# EAGLE design Stericlinic_01 (EAGLE 6.3)

## Sheet 1 of 3
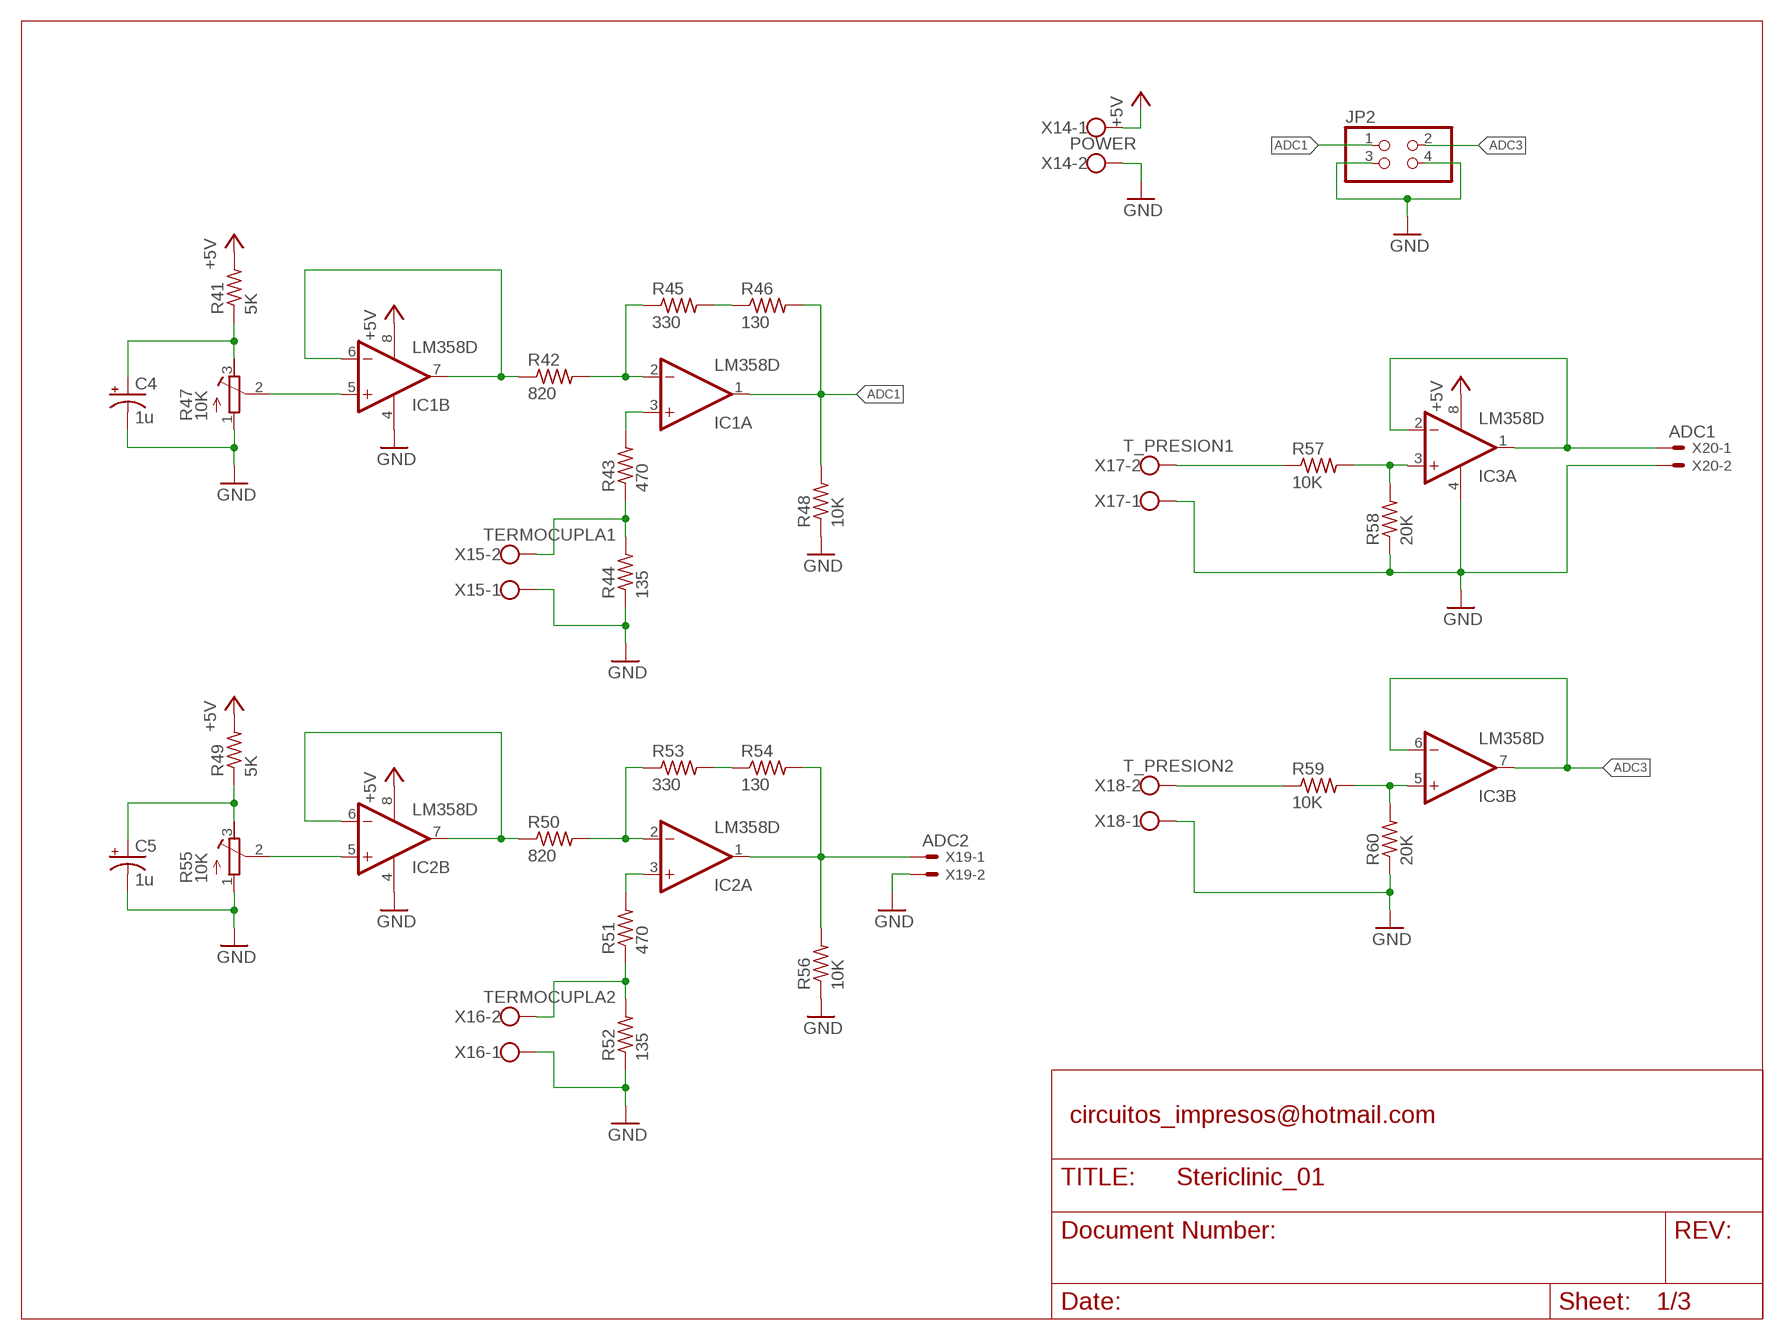
[diagram p0: schematic, sheet 1]

### Parts
C4  1u  CPOL-USB/3528-21W  [B/3528-21W]
C5  1u  CPOL-USB/3528-21W  [B/3528-21W]
IC1  LM358D  [SO08]
IC2  LM358D  [SO08]
IC3  LM358D  [SO08]
JP2  PINHD-2X2  [2X02]
R41  5K  R-US_R1206  [R1206]
R42  820  R-US_R0603  [R0603]
R43  470  R-US_R0603  [R0603]
R44  135  R-US_R0603  [R0603]
R45  330  R-US_R0603  [R0603]
R46  130  R-US_R0603  [R0603]
R47  10K  R-TRIMM64W  [RTRIM64W]
R48  10K  R-US_R0603  [R0603]
R49  5K  R-US_R1206  [R1206]
R50  820  R-US_R0603  [R0603]
R51  470  R-US_R0603  [R0603]
R52  135  R-US_R0603  [R0603]
R53  330  R-US_R0603  [R0603]
R54  130  R-US_R0603  [R0603]
R55  10K  R-TRIMM64W  [RTRIM64W]
R56  10K  R-US_R0603  [R0603]
R57  10K  R-US_R0603  [R0603]
R58  20K  R-US_R0603  [R0603]
R59  10K  R-US_R0603  [R0603]
R60  20K  R-US_R0603  [R0603]
X14  POWER  W237-102  [W237-102]
X15  TERMOCUPLA1  W237-102  [W237-102]
X16  TERMOCUPLA2  W237-102  [W237-102]
X17  T_PRESION1  W237-102  [W237-102]
X18  T_PRESION2  W237-102  [W237-102]
X19  ADC2  22-23-2021  [22-23-2021]
X20  ADC1  22-23-2021  [22-23-2021]

### Nets
+5V: IC1.8(P:V+) IC2.8(P:V+) IC3.8(P:V+) R41.2 R49.2 X14.1 ; also sheet 2,3
ADC1: IC1.1(A:OUT) JP2.1 R46.2 R48.2
ADC2: IC2.1(A:OUT) R54.2 R56.2 X19.1
ADC3: IC3.6(B:-IN) IC3.7(B:OUT) JP2.2
GND: C4.- C5.- IC1.4(P:V-) IC2.4(P:V-) IC3.4(P:V-) JP2.3 JP2.4 R44.1 R47.1(A) R48.1 R52.1 R55.1(A) R56.1 R58.1 R60.1 X14.2 X15.1 X16.1 X17.1 X18.1 X19.2 X20.2 ; also sheet 2,3
N$30: C4.+ R41.1 R47.3(E)
N$36: IC1.5(B:+IN) R47.2(S)
N$42: IC1.6(B:-IN) IC1.7(B:OUT) R42.1
N$43: IC1.2(A:-IN) R42.2 R45.1
N$44: R45.2 R46.1
N$46: R43.1 R44.2 X15.2
N$47: IC3.3(A:+IN) R57.2 R58.2
N$48: IC1.3(A:+IN) R43.2
N$49: C5.+ R49.1 R55.3(E)
N$50: IC2.5(B:+IN) R55.2(S)
N$51: IC2.6(B:-IN) IC2.7(B:OUT) R50.1
N$52: IC2.2(A:-IN) R50.2 R53.1
N$53: R53.2 R54.1
N$54: R51.1 R52.2 X16.2
N$55: IC2.3(A:+IN) R51.2
N$56: IC3.1(A:OUT) IC3.2(A:-IN) X20.1
N$57: R57.1 X17.2
N$58: IC3.5(B:+IN) R59.2 R60.2
N$59: R59.1 X18.2

### Notes on the sheet
- circuitos_impresos@hotmail.com

## Sheet 2 of 3
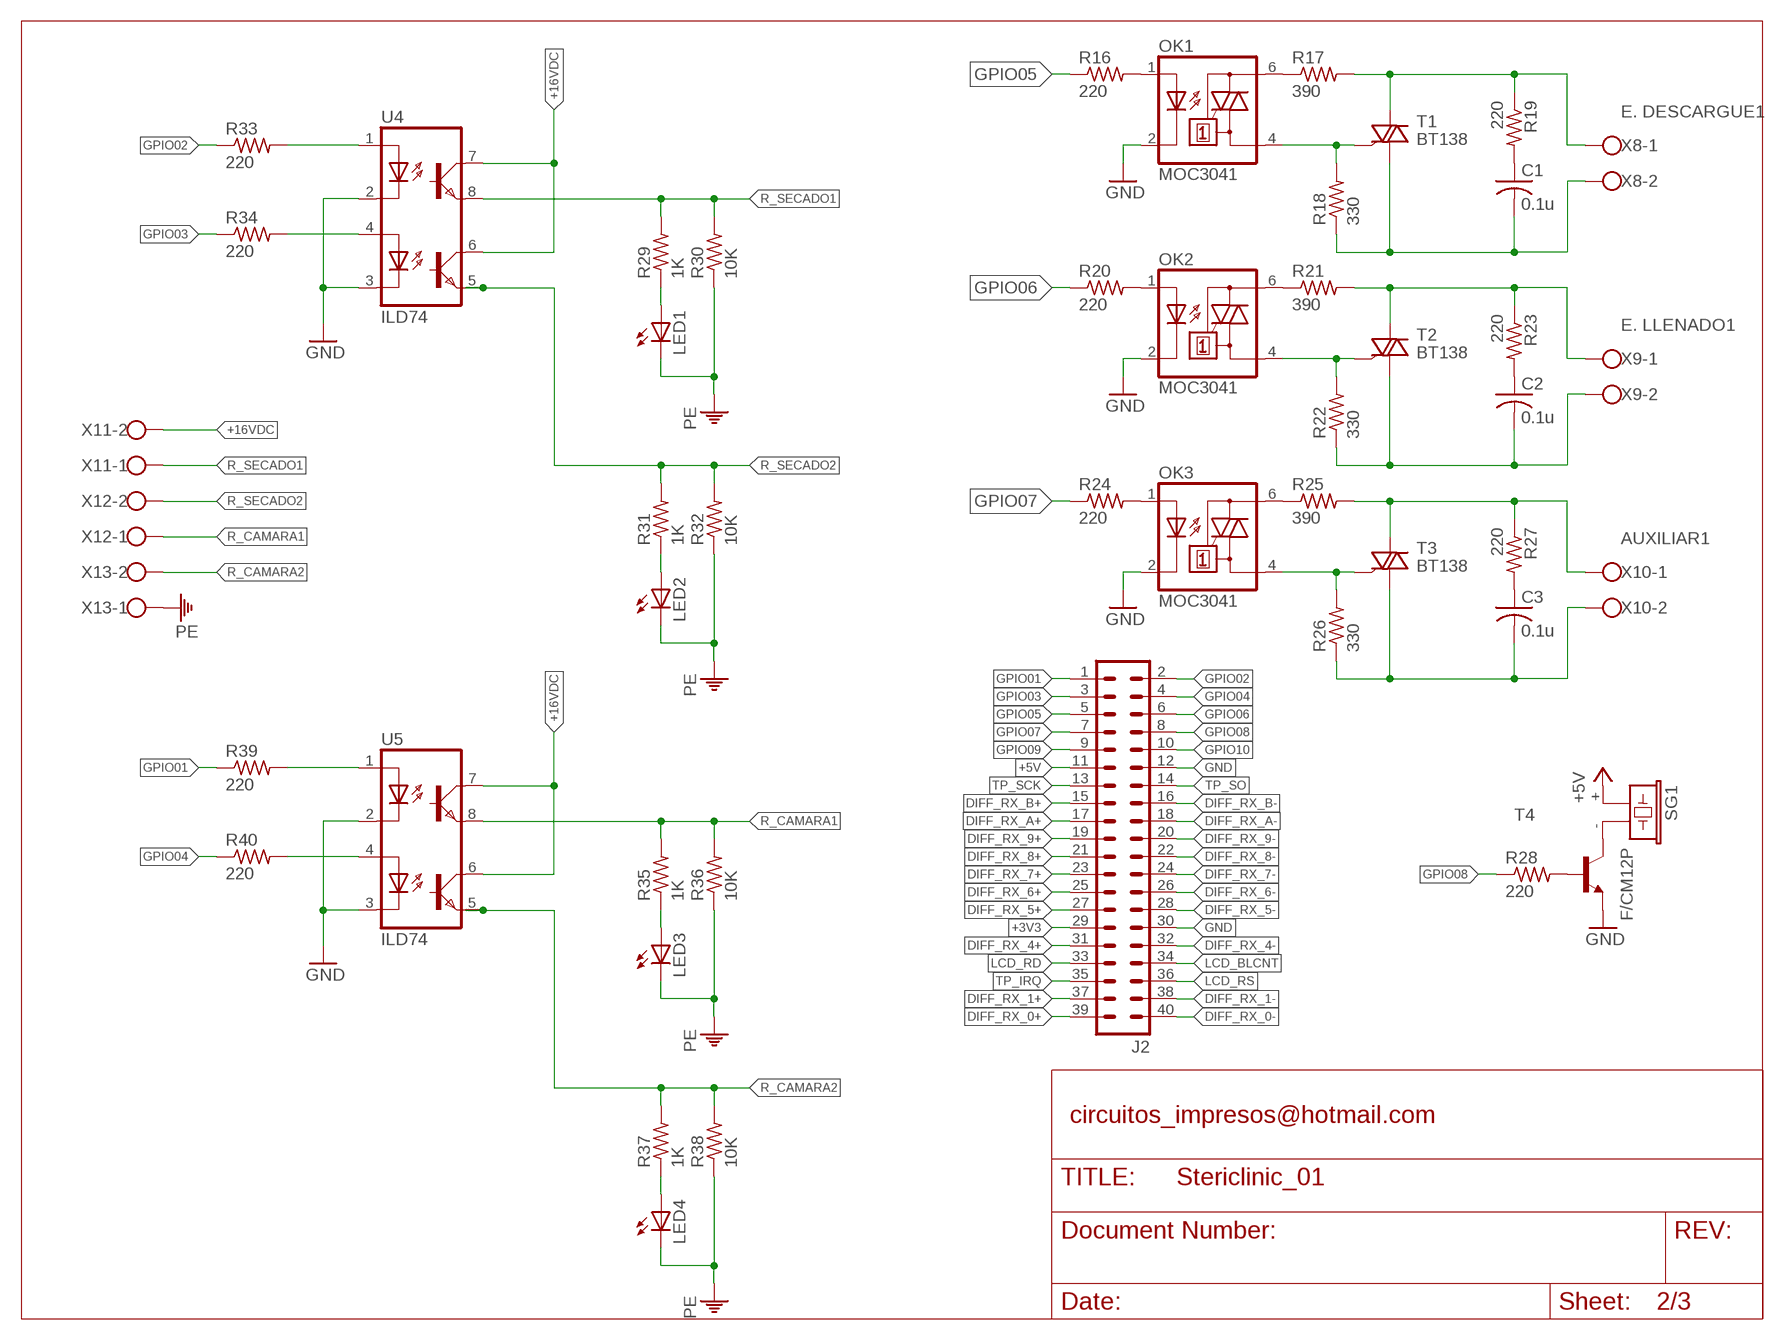
[diagram p1: schematic, sheet 2]

### Parts
C1  0.1u  C-US075-042X103  [C075-042X103]
C2  0.1u  C-US075-042X103  [C075-042X103]
C3  0.1u  C-US075-042X103  [C075-042X103]
J2  ML40  [ML40]
LED1  LEDCHIP-LED0805  [CHIP-LED0805]
LED2  LEDCHIP-LED0805  [CHIP-LED0805]
LED3  LEDCHIP-LED0805  [CHIP-LED0805]
LED4  LEDCHIP-LED0805  [CHIP-LED0805]
OK1  MOC3041  MOC3041M  [DIL06]
OK2  MOC3041  MOC3041M  [DIL06]
OK3  MOC3041  MOC3041M  [DIL06]
R16  220  R-US_R0603  [R0603]
R17  390  R-US_0207/7  [0207/7]
R18  330  R-US_0207/7  [0207/7]
R19  220  R-US_0309/10  [0309/10]
R20  220  R-US_R0603  [R0603]
R21  390  R-US_0207/7  [0207/7]
R22  330  R-US_0207/7  [0207/7]
R23  220  R-US_0309/10  [0309/10]
R24  220  R-US_R0603  [R0603]
R25  390  R-US_0207/7  [0207/7]
R26  330  R-US_0207/7  [0207/7]
R27  220  R-US_0309/10  [0309/10]
R28  220  R-US_R0603  [R0603]
R29  1K  R-US_M0805  [M0805]
R30  10K  R-US_R0805  [R0805]
R31  1K  R-US_R0805  [R0805]
R32  10K  R-US_R0805  [R0805]
R33  220  R-US_R0603  [R0603]
R34  220  R-US_R0603  [R0603]
R35  1K  R-US_R0805  [R0805]
R36  10K  R-US_R0805  [R0805]
R37  1K  R-US_R0805  [R0805]
R38  10K  R-US_R0805  [R0805]
R39  220  R-US_R0603  [R0603]
R40  220  R-US_R0603  [R0603]
SG1  F/CM12P  [F/CM12P]
T1  BT138  BT138-V  [TO220BV]
T2  BT138  BT138-V  [TO220BV]
T3  BT138  BT138-V  [TO220BV]
T4  MMBT2222ALT1-NPN-SOT23-BEC  [SOT23-BEC]
U4  ILD74  [DIL08]
U5  ILD74  [DIL08]
X8  E. DESCARGUE1  W237-102  [W237-102]
X9  E. LLENADO1  W237-102  [W237-102]
X10  AUXILIAR1  W237-102  [W237-102]
X11  W237-102  [W237-102]
X12  W237-102  [W237-102]
X13  W237-102  [W237-102]

### Nets
+3V3: J2.29 ; also sheet 3
+5V: J2.11 SG1.+ ; also sheet 1,3
+16VDC: U4.6(COL2) U4.7(COL1) U5.6(COL2) U5.7(COL1) X11.2
DIFF_RX_0+: J2.39 ; also sheet 3
DIFF_RX_0-: J2.40 ; also sheet 3
DIFF_RX_1+: J2.37 ; also sheet 3
DIFF_RX_1-: J2.38 ; also sheet 3
DIFF_RX_4+: J2.31 ; also sheet 3
DIFF_RX_4-: J2.32 ; also sheet 3
DIFF_RX_5+: J2.27 ; also sheet 3
DIFF_RX_5-: J2.28 ; also sheet 3
DIFF_RX_6+: J2.25 ; also sheet 3
DIFF_RX_6-: J2.26 ; also sheet 3
DIFF_RX_7+: J2.23 ; also sheet 3
DIFF_RX_7-: J2.24 ; also sheet 3
DIFF_RX_8+: J2.21 ; also sheet 3
DIFF_RX_8-: J2.22 ; also sheet 3
DIFF_RX_9+: J2.19 ; also sheet 3
DIFF_RX_9-: J2.20 ; also sheet 3
DIFF_RX_A+: J2.17 ; also sheet 3
DIFF_RX_A-: J2.18 ; also sheet 3
DIFF_RX_B+: J2.15 ; also sheet 3
DIFF_RX_B-: J2.16 ; also sheet 3
GND: J2.12 J2.30 OK1.2(C) OK2.2(C) OK3.2(C) T4.E U4.2(C1) U4.3(C12) U5.2(C1) U5.3(C12) ; also sheet 1,3
GPIO01: J2.1 R39.1
GPIO02: J2.2 R33.1
GPIO03: J2.3 R34.1
GPIO04: J2.4 R40.1
GPIO05: J2.5 R16.1
GPIO06: J2.6 R20.1
GPIO07: J2.7 R24.1
GPIO08: J2.8 R28.1
GPIO09: J2.9 ; also sheet 3
GPIO10: J2.10
LCD_BLCNT: J2.34 ; also sheet 3
LCD_RD: J2.33 ; also sheet 3
LCD_RS: J2.36 ; also sheet 3
N$10: OK1.1(A) R16.2
N$11: R28.2 T4.B
N$12: OK2.1(A) R20.2
N$13: OK1.4(A1) R18.2 T1.G
N$14: OK1.6(A2) R17.1
N$15: R17.2 R19.1 T1.T2(A2) X8.1
N$16: C1.2 R18.1 T1.T1(A1) X8.2
N$17: C1.1 R19.2
N$18: OK2.4(A1) R22.2 T2.G
N$19: OK2.6(A2) R21.1
N$20: R21.2 R23.1 T2.T2(A2) X9.1
N$21: C2.2 R22.1 T2.T1(A1) X9.2
N$22: C2.1 R23.2
N$23: OK3.1(A) R24.2
N$24: OK3.4(A1) R26.2 T3.G
N$25: OK3.6(A2) R25.1
N$26: R25.2 R27.1 T3.T2(A2) X10.1
N$27: C3.2 R26.1 T3.T1(A1) X10.2
N$28: C3.1 R27.2
N$29: SG1.- T4.C
N$31: R33.2 U4.1(A1)
N$32: LED1.A R29.1
N$33: LED2.A R31.1
N$34: R34.2 U4.4(A2)
N$37: LED3.A R35.1
N$39: LED4.A R37.1
N$40: R39.2 U5.1(A1)
N$41: R40.2 U5.4(A2)
PE: LED1.C LED2.C LED3.C LED4.C R30.1 R32.1 R36.1 R38.1 X13.1
R_CAMARA1: R35.2 R36.2 U5.8(EMI1) X12.1
R_CAMARA2: R37.2 R38.2 U5.5(EMI2) X13.2
R_SECADO1: R29.2 R30.2 U4.8(EMI1) X11.1
R_SECADO2: R31.2 R32.2 U4.5(EMI2) X12.2
TP_IRQ: J2.35 ; also sheet 3
TP_SCK: J2.13 ; also sheet 3
TP_SO: J2.14 ; also sheet 3

### Notes on the sheet
- circuitos_impresos@hotmail.com

## Sheet 3 of 3
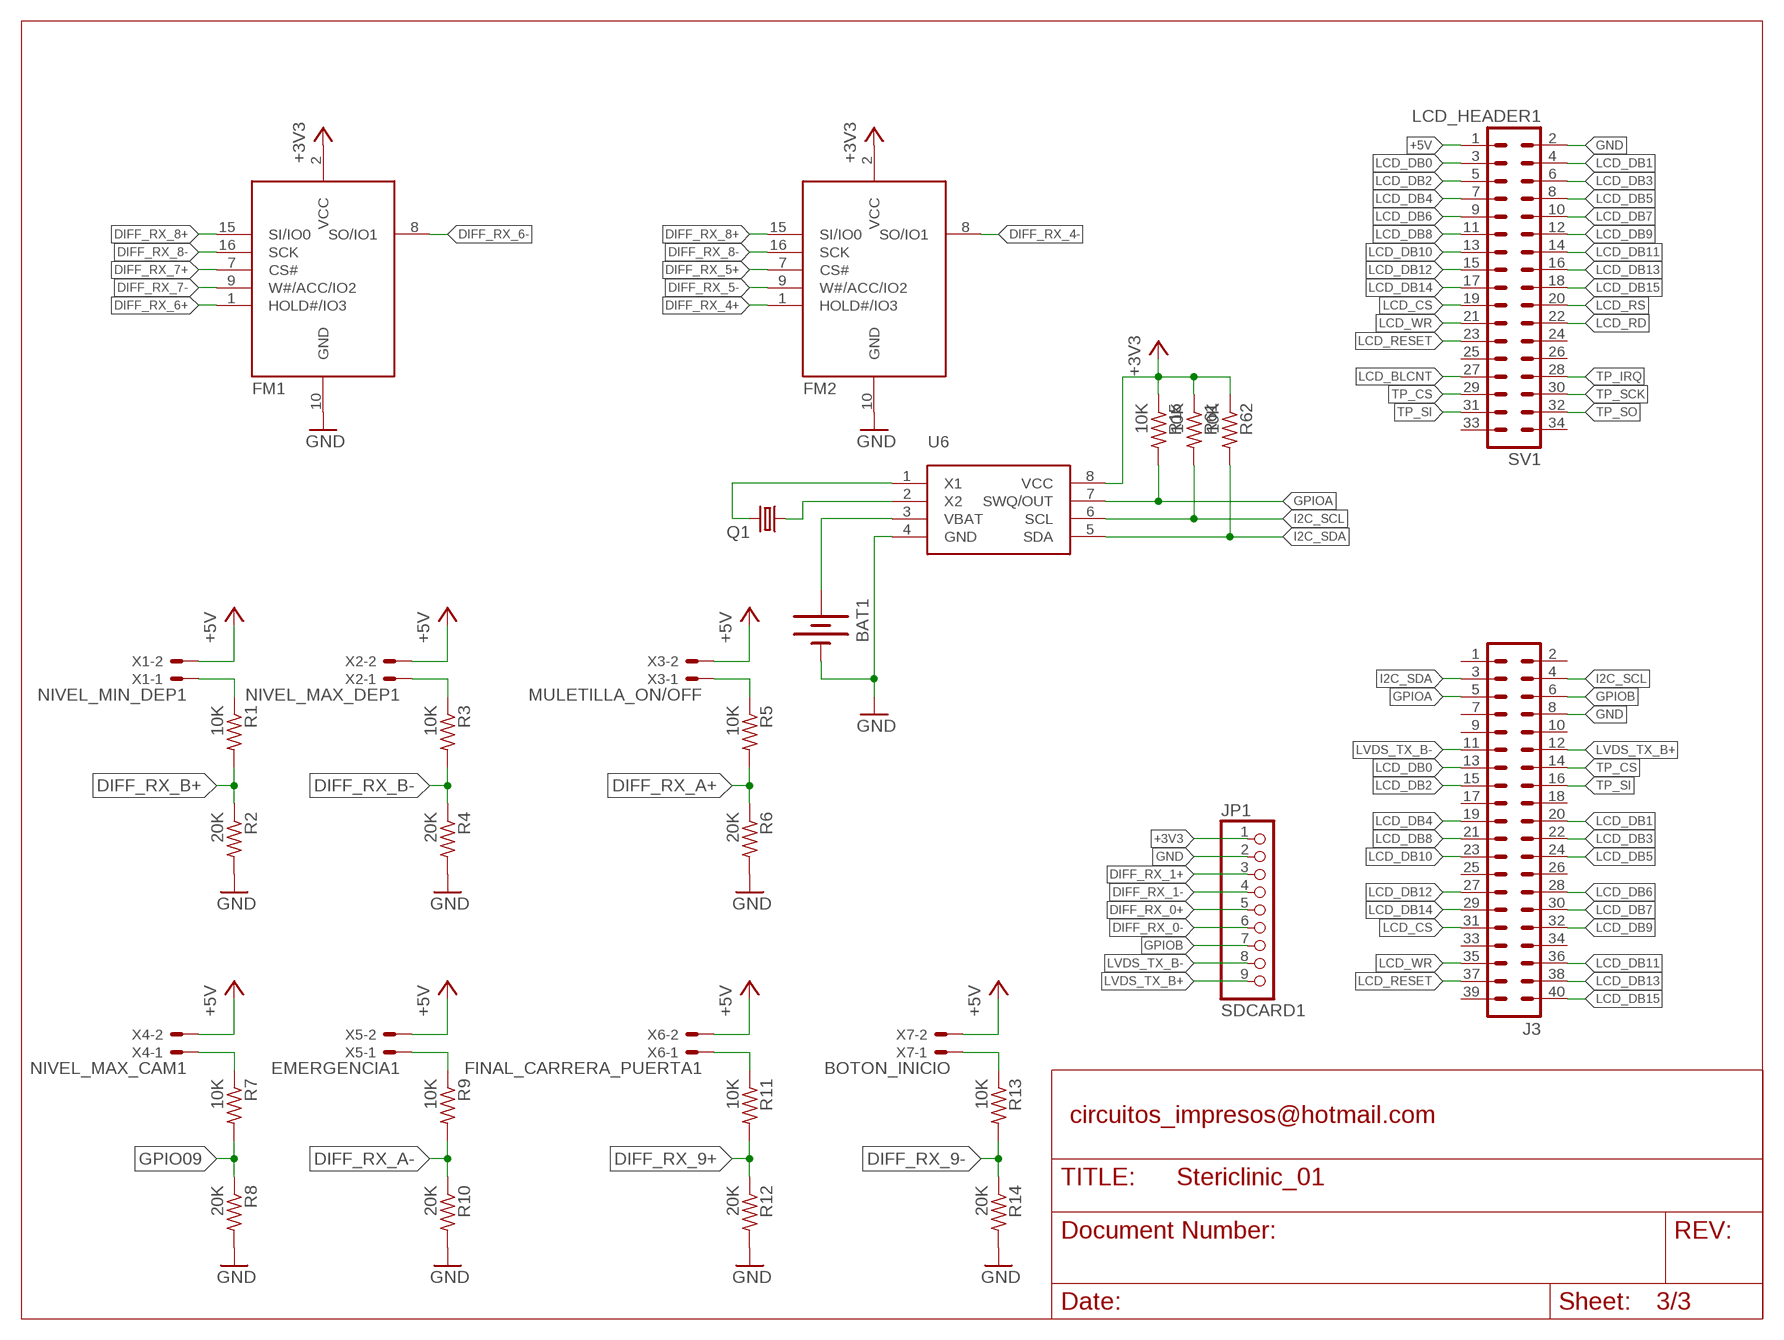
[diagram p2: schematic, sheet 3]

### Parts
BAT1  BATTERY20PTH  [BATTCOM_20MM_PTH]
FM1  S25FL064P  [SO16]
FM2  S25FL064P  [SO16]
J3  ML40  [ML40]
JP1  SDCARD1  PINHD-1X9  [1X09]
Q1  CRYSTALTC26H  [TC26H]
R1  10K  R-US_R0603  [R0603]
R2  20K  R-US_R0603  [R0603]
R3  10K  R-US_R0603  [R0603]
R4  20K  R-US_R0603  [R0603]
R5  10K  R-US_R0603  [R0603]
R6  20K  R-US_R0603  [R0603]
R7  10K  R-US_R0603  [R0603]
R8  20K  R-US_R0603  [R0603]
R9  10K  R-US_R0603  [R0603]
R10  20K  R-US_R0603  [R0603]
R11  10K  R-US_R0603  [R0603]
R12  20K  R-US_R0603  [R0603]
R13  10K  R-US_R0603  [R0603]
R14  20K  R-US_R0603  [R0603]
R15  10K  R-US_R0603  [R0603]
R61  10K  R-US_R0603  [R0603]
R62  10K  R-US_R0603  [R0603]
SV1  LCD_HEADER1  ML34  [ML34]
U6  DS1338  [SO08]
X1  NIVEL_MIN_DEP1  22-23-2021  [22-23-2021]
X2  NIVEL_MAX_DEP1  22-23-2021  [22-23-2021]
X3  MULETILLA_ON/OFF  22-23-2021  [22-23-2021]
X4  NIVEL_MAX_CAM1  22-23-2021  [22-23-2021]
X5  EMERGENCIA1  22-23-2021  [22-23-2021]
X6  FINAL_CARRERA_PUERTA1  22-23-2021  [22-23-2021]
X7  BOTON_INICIO  22-23-2021  [22-23-2021]

### Nets
+3V3: FM1.2(VCC) FM2.2(VCC) JP1.1 R15.1 R61.1 R62.1 U6.8(VCC) ; also sheet 2
+5V: SV1.1 X1.2 X2.2 X3.2 X4.2 X5.2 X6.2 X7.2 ; also sheet 1,2
DIFF_RX_0+: JP1.5 ; also sheet 2
DIFF_RX_0-: JP1.6 ; also sheet 2
DIFF_RX_1+: JP1.3 ; also sheet 2
DIFF_RX_1-: JP1.4 ; also sheet 2
DIFF_RX_4+: FM2.1(HOLD#/IO3) ; also sheet 2
DIFF_RX_4-: FM2.8(SO/IO1) ; also sheet 2
DIFF_RX_5+: FM2.7(CS#) ; also sheet 2
DIFF_RX_5-: FM2.9(W#/ACC/IO2) ; also sheet 2
DIFF_RX_6+: FM1.1(HOLD#/IO3) ; also sheet 2
DIFF_RX_6-: FM1.8(SO/IO1) ; also sheet 2
DIFF_RX_7+: FM1.7(CS#) ; also sheet 2
DIFF_RX_7-: FM1.9(W#/ACC/IO2) ; also sheet 2
DIFF_RX_8+: FM1.15(SI/IO0) FM2.15(SI/IO0) ; also sheet 2
DIFF_RX_8-: FM1.16(SCK) FM2.16(SCK) ; also sheet 2
DIFF_RX_9+: R11.2 R12.1 ; also sheet 2
DIFF_RX_9-: R13.2 R14.1 ; also sheet 2
DIFF_RX_A+: R5.2 R6.1 ; also sheet 2
DIFF_RX_A-: R9.2 R10.1 ; also sheet 2
DIFF_RX_B+: R1.2 R2.1 ; also sheet 2
DIFF_RX_B-: R3.2 R4.1 ; also sheet 2
GND: BAT1.2(-) FM1.10(GND) FM2.10(GND) J3.8 JP1.2 R2.2 R4.2 R6.2 R8.2 R10.2 R12.2 R14.2 SV1.2 U6.4(GND) ; also sheet 1,2
GPIO09: R7.2 R8.1 ; also sheet 2
GPIOA: J3.5 R15.2 U6.7(SWQ/OUT)
GPIOB: J3.6 JP1.7
I2C_SCL: J3.4 R61.2 U6.6(SCL)
I2C_SDA: J3.3 R62.2 U6.5(SDA)
LCD_BLCNT: SV1.27 ; also sheet 2
LCD_CS: J3.31 SV1.19
LCD_DB0: J3.13 SV1.3
LCD_DB1: J3.20 SV1.4
LCD_DB2: J3.15 SV1.5
LCD_DB3: J3.22 SV1.6
LCD_DB4: J3.19 SV1.7
LCD_DB5: J3.24 SV1.8
LCD_DB6: J3.28 SV1.9
LCD_DB7: J3.30 SV1.10
LCD_DB8: J3.21 SV1.11
LCD_DB9: J3.32 SV1.12
LCD_DB10: J3.23 SV1.13
LCD_DB11: J3.36 SV1.14
LCD_DB12: J3.27 SV1.15
LCD_DB13: J3.38 SV1.16
LCD_DB14: J3.29 SV1.17
LCD_DB15: J3.40 SV1.18
LCD_RD: SV1.22 ; also sheet 2
LCD_RESET: J3.37 SV1.23
LCD_RS: SV1.20 ; also sheet 2
LCD_WR: J3.35 SV1.21
LVDS_TX_B+: J3.12 JP1.9
LVDS_TX_B-: J3.11 JP1.8
N$1: Q1.2 U6.1(X1)
N$2: R1.1 X1.1
N$3: R3.1 X2.1
N$4: R5.1 X3.1
N$5: R7.1 X4.1
N$6: R9.1 X5.1
N$7: R11.1 X6.1
N$8: R13.1 X7.1
N$9: Q1.1 U6.2(X2)
N$35: BAT1.1(+) U6.3(VBAT)
TP_CS: J3.14 SV1.29
TP_IRQ: SV1.28 ; also sheet 2
TP_SCK: SV1.30 ; also sheet 2
TP_SI: J3.16 SV1.31
TP_SO: SV1.32 ; also sheet 2
Unconnected: J3.1 J3.2 J3.7 J3.9 J3.10 J3.17 J3.18 J3.25 J3.26 J3.33 J3.34 J3.39 SV1.24 SV1.25 SV1.26 SV1.33 SV1.34

### Notes on the sheet
- circuitos_impresos@hotmail.com

## Library data of the parts
BAT1 = SparkFun:BATTERY: Battery Holders Various common sizes : AA, AAA, 20mm coin cell and 12mm coin cell.
C1-C3 = rcl:C-US: CAPACITOR, American symbol
C4 C5 = rcl:CPOL-US: POLARIZED CAPACITOR, American symbol
FM1 FM2 = STERICLINIC:S25FL064P
IC1-IC3 = linear:LM358: OP AMP also LM158; LM258; LM2904 Source: http://cache.national.com/ds/LM/LM158.pdf
J2 J3 = con-harting-ml:ML40: HARTING; OC_FARNELL: unknown; OC_NEWARK: unknown
JP1 = pinhead:PINHD-1X9: PIN HEADER
JP2 = pinhead:PINHD-2X2: PIN HEADER
LED1-LED4 = led:LED: LED OSRAM: - CHIPLED LG R971, LG N971, LY N971, LG Q971, LY Q971, LO R971, LY R971 LH N974, LH R974 LS Q976, LO Q976, LY Q976 LO Q996 - Hyper CHIPLED LW Q18S LB Q993, LB Q99A, LB R99A - SideLED LS A670, LO A670, LY A670, LG A670, LP A670 LB A673, LV A673, LT A673, LW A673 LH A674 LY A675 LS A676, LA A676, LO A676, LY A676, LW A676 LS A679, LY A679, LG A679 - Hyper Micro SIDELED® LS Y876, LA Y876, LO Y876, LY Y876 LT Y87S - SmartLED LW L88C, LW L88S LB L89C, LB L89S, LG L890 LS L89K, LO L89K, LY L89K LS L896, LA L896, LO L896, LY L896 - TOPLED LS T670, LO T670, LY T670, LG T670, LP T670 LSG T670, LSP T670, LSY T670, LOP T670, LYG T670 LG T671, LOG T671, LSG T671 LB T673, LV T673, LT T673, LW T673 LH T674 LS T676, LA T676, LO T676, LY T676, LB T676, LH T676, LSB T676, LW T676 LB T67C, LV T67C, LT T67C, LS T67K, LO T67K, LY T67K, LW E67C LS E67B, LA E67B, LO E67B, LY E67B, LB E67C, LV E67C, LT E67C LW T67C LS T679, LY T679, LG T679 LS T770, LO T770, LY T770, LG T770, LP T770 LB T773, LV T773, LT T773, LW T773 LH T774 LS E675, LA E675, LY E675, LS T675 LS T776, LA T776, LO T776, LY T776, LB T776 LHGB T686 LT T68C, LB T68C - Hyper Mini TOPLED® LB M676 - Mini TOPLED Santana® LG M470 LS M47K, LO M47K, LY M47K Source: http://www.osram.convergy.de LUXEON: - LUMILED® LXK2-PW12-R00, LXK2-PW12-S00, LXK2-PW14-U00, LXK2-PW14-V00 LXK2-PM12-R00, LXK2-PM12-S00, LXK2-PM14-U00 LXK2-PE12-Q00, LXK2-PE12-R00, LXK2-PE12-S00, LXK2-PE14-T00, LXK2-PE14-U00 LXK2-PB12-K00, LXK2-PB12-L00, LXK2-PB12-M00, LXK2-PB14-N00, LXK2-PB14-P00, LXK2-PB14-Q00 LXK2-PR12-L00, LXK2-PR12-M00, LXK2-PR14-Q00, LXK2-PR14-R00 LXK2-PD12-Q00, LXK2-PD12-R00, LXK2-PD12-S00 LXK2-PH12-R00, LXK2-PH12-S00 LXK2-PL12-P00, LXK2-PL12-Q00, LXK2-PL12-R00 Source: www.luxeon.com KINGBRIGHT: KA-3528ASYC Source: www.kingbright.com
OK1-OK3 = optocoupler:MOC30*: 6-Pin DIP Zero-Cross Optoisolators Triac Driver Output (250/400 Volt Peak) Source: http://www.fairchildsemi.com/ds/MO/MOC3043-M.pdf; MF: FAIRCHILD SEMICONDUCTOR; MPN: MOC3041M; OC_FARNELL: 1086677; OC_NEWARK: 78K6090
Q1 = crystal:CRYSTAL: CRYSTAL; OC_FARNELL: unknown; OC_NEWARK: unknown
R1-R46 R48-R54 R56-R62 = rcl:R-US_: RESISTOR, American symbol
R47 R55 = rcl:R-TRIMM: Trimm resistor
SG1 = buzzer:F/CM12P: BUZZER Source: Buerklin; OC_FARNELL: unknown; OC_NEWARK: unknown
SV1 = con-harting-ml:ML34: HARTING; OC_FARNELL: unknown; OC_NEWARK: unknown
T1-T3 = triac:BT138: TRIAC Source: http://www.semiconductors.philips.com BT138_SERIES_2.pdf
T4 = transistor:*-NPN-: NPN Transistror BF959 corrected 2008.03.06
U4 U5 = STERICLINIC:ILD74
U6 = STERICLINIC:DS1338
X1-X7 X19 X20 = con-molex:22-23-2021: .100" (2.54mm) Center Header - 2 Pin; MF: MOLEX; MPN: 22-23-2021; OC_FARNELL: 1462926; OC_NEWARK: 25C3832
X8-X18 = con-wago-500:W237-102: WAGO SCREW CLAMP; MPN: 237-102; OC_FARNELL: unknown; OC_NEWARK: 70K9898

## Board
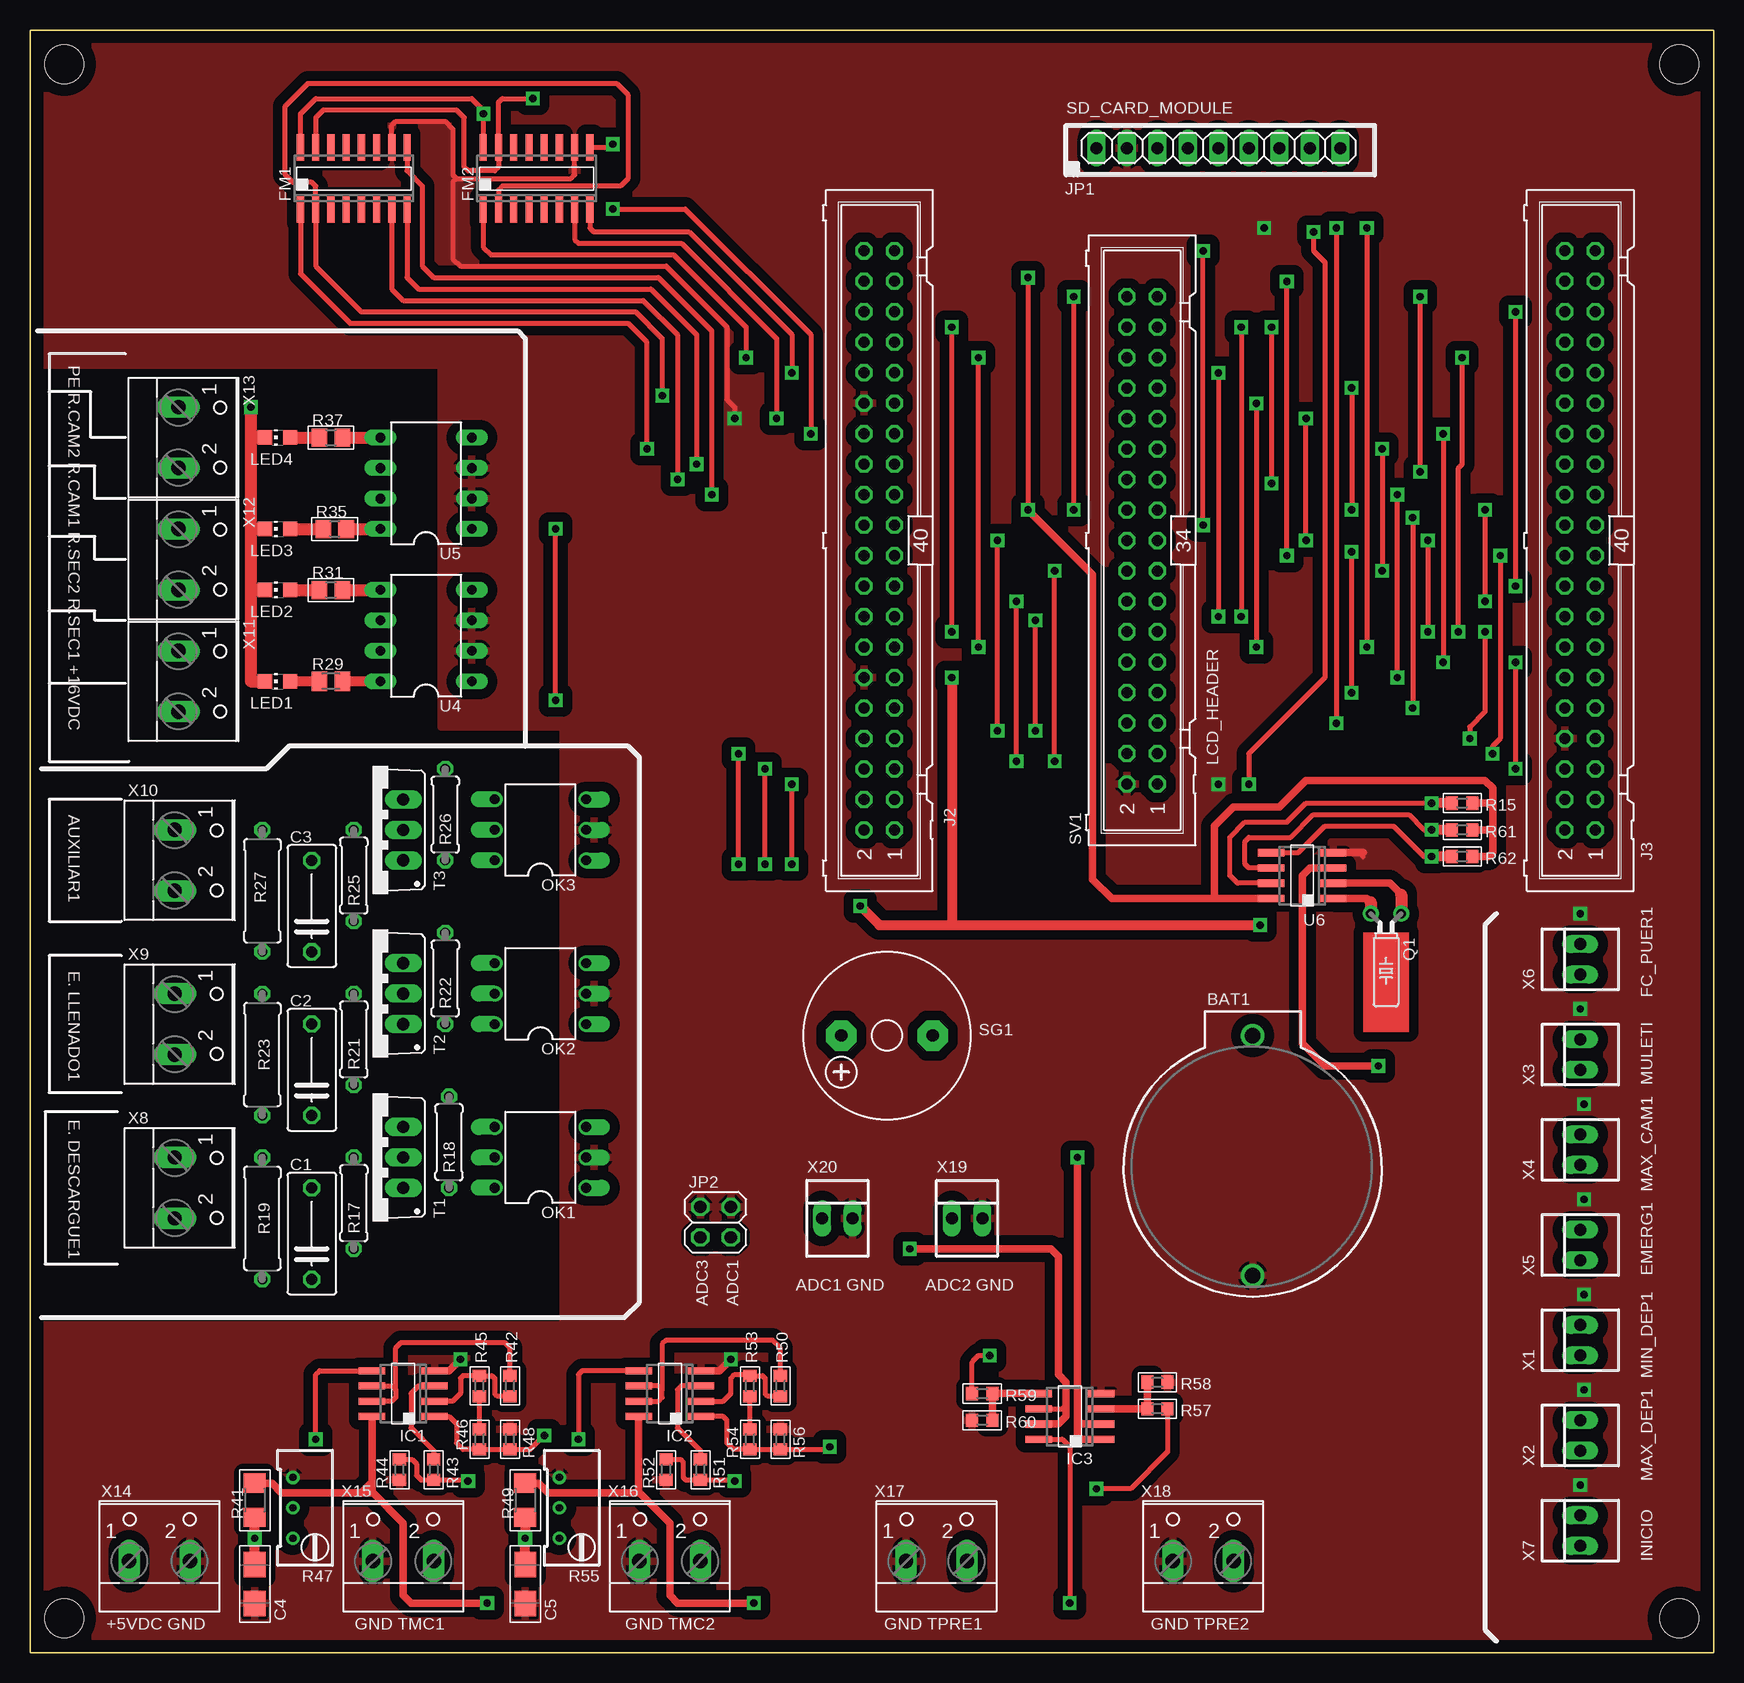
[diagram p3: board, top side]
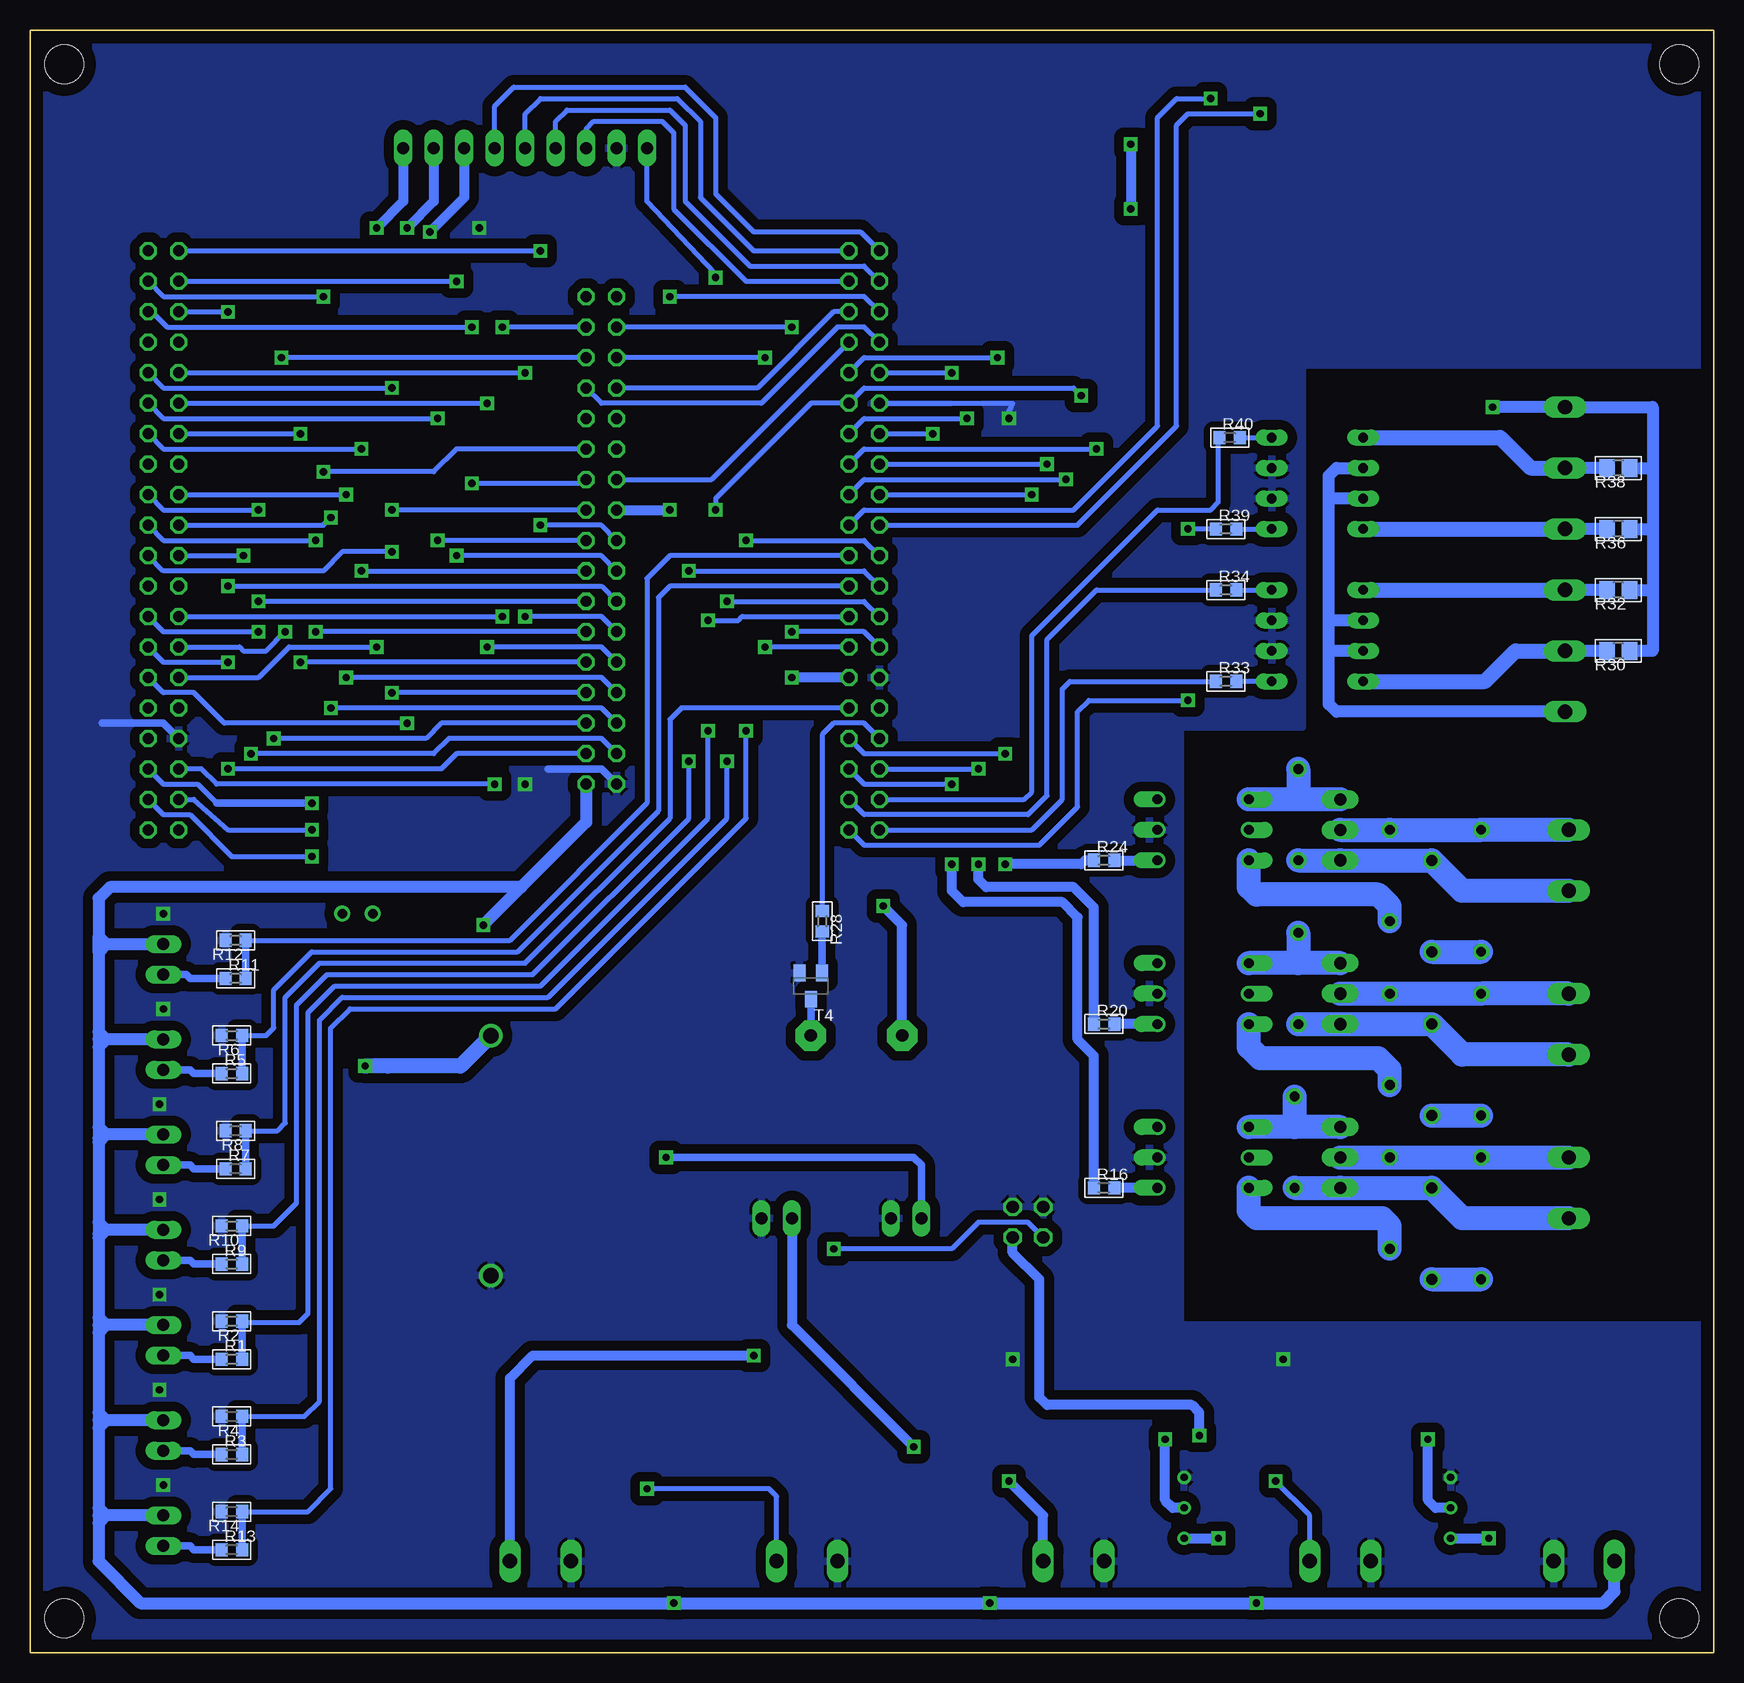
[diagram p4: board, bottom side, seen from below]

Size 140.34 x 135.25 mm. Coordinates in mm from the lower left corner, seen from the top.
Outline: 0,0 140.34,0 140.34,135.25 0,135.25 0,0
Copper layers (1*16): Top 0.035mm / dielectric 1.5mm / Bottom 0.035mm
Design rules "default": minimum track width 10mil, minimum drill 24mil, track to track 8mil, track to pad 8mil, pad to pad 8mil, via to via 8mil, smd to smd 8mil, copper to edge 40mil, drill to drill 8mil, minimum pad ring 10mil, minimum via ring 8mil, stop-mask expansion 4mil, vias tented up to drill 0mil, thermal gap 10mil
Holes 3.2 mm at 2.86,132.4 137.48,132.4 137.48,2.86 2.86,2.86

### Footprints (pad centres in the part's own frame; a part is rotated, then mirrored left to right if it is on the bottom)
BATTCOM_20MM_PTH = drill 1.3: 1 20,0; 2 0,0
C075-042X103 = drill 0.914 octagon: 1 -3.81,0; 2 3.81,0
B/3528-21W = smd 2.15 x 1.8: + 1.625,0; - -1.625,0
SO16 = smd 0.6 x 2.2: 1 -4.445,-2.6; 2 -3.175,-2.6; 3 -1.905,-2.6; 4 -0.635,-2.6; 5 0.635,-2.6; 6 1.905,-2.6; 7 3.175,-2.6; 8 4.445,-2.6; 9 4.445,2.6; 10 3.175,2.6; 11 1.905,2.6; 12 0.635,2.6; 13 -0.635,2.6; 14 -1.905,2.6; 15 -3.175,2.6; 16 -4.445,2.6
SO08 = smd 0.6 x 2.2: 1 -1.905,-2.6; 2 -0.635,-2.6; 3 0.635,-2.6; 4 1.905,-2.6; 5 1.905,2.6; 6 0.635,2.6; 7 -0.635,2.6; 8 -1.905,2.6
ML40 = drill 0.914 octagon: 1 -24.13,-1.27; 2 -24.13,1.27; 3 -21.59,-1.27; 4 -21.59,1.27; 5 -19.05,-1.27; 6 -19.05,1.27; 7 -16.51,-1.27; 8 -16.51,1.27; 9 -13.97,-1.27; 10 -13.97,1.27; 11 -11.43,-1.27; 12 -11.43,1.27; 13 -8.89,-1.27; 14 -8.89,1.27; 15 -6.35,-1.27; 16 -6.35,1.27; 17 -3.81,-1.27; 18 -3.81,1.27; 19 -1.27,-1.27; 20 -1.27,1.27; 21 1.27,-1.27; 22 1.27,1.27; 23 3.81,-1.27; 24 3.81,1.27; 25 6.35,-1.27; 26 6.35,1.27; 27 8.89,-1.27; 28 8.89,1.27; 29 11.43,-1.27; 30 11.43,1.27; 31 13.97,-1.27; 32 13.97,1.27; 33 16.51,-1.27; 34 16.51,1.27; 35 19.05,-1.27; 36 19.05,1.27; 37 21.59,-1.27; 38 21.59,1.27; 39 24.13,-1.27; 40 24.13,1.27
1X09 = drill 1.016 long: 1 -10.16,0; 2 -7.62,0; 3 -5.08,0; 4 -2.54,0; 5 0,0; 6 2.54,0; 7 5.08,0; 8 7.62,0; 9 10.16,0
2X02 = drill 1.016 octagon: 1 -1.27,-1.27; 2 -1.27,1.27; 3 1.27,-1.27; 4 1.27,1.27
CHIP-LED0805 = smd 1.2 x 1.2: A 0,-1.05; C 0,1.05
DIL06 = drill 0.813 offset: 1 -2.54,-3.81; 2 0,-3.81; 3 2.54,-3.81; 4 2.54,3.81; 5 0,3.81; 6 -2.54,3.81
TC26H = drill 0.813: 1 -1.27,0; 2 1.27,0
R0603 = smd 1 x 1.1: 1 -0.85,0; 2 0.85,0
0207/7 = drill 0.813 octagon: 1 -3.81,0; 2 3.81,0
0309/10 = drill 0.813 octagon: 1 -5.08,0; 2 5.08,0
M0805 = smd 1.3 x 1.6: 1 -0.95,0; 2 0.95,0
R0805 = smd 1.3 x 1.5: 1 -0.95,0; 2 0.95,0
R1206 = smd 1.6 x 1.803: 1 -1.422,0; 2 1.422,0
RTRIM64W = drill 0.61: 1 1.27,-2.54; 2 1.27,0; 3 1.27,2.54
F/CM12P = drill 1.016 pad 2.54 octagon: + 3.81,0; - -3.81,0
ML34 = drill 0.914 octagon: 1 -20.32,-1.27; 2 -20.32,1.27; 3 -17.78,-1.27; 4 -17.78,1.27; 5 -15.24,-1.27; 6 -15.24,1.27; 7 -12.7,-1.27; 8 -12.7,1.27; 9 -10.16,-1.27; 10 -10.16,1.27; 11 -7.62,-1.27; 12 -7.62,1.27; 13 -5.08,-1.27; 14 -5.08,1.27; 15 -2.54,-1.27; 16 -2.54,1.27; 17 0,-1.27; 18 0,1.27; 19 2.54,-1.27; 20 2.54,1.27; 21 5.08,-1.27; 22 5.08,1.27; 23 7.62,-1.27; 24 7.62,1.27; 25 10.16,-1.27; 26 10.16,1.27; 27 12.7,-1.27; 28 12.7,1.27; 29 15.24,-1.27; 30 15.24,1.27; 31 17.78,-1.27; 32 17.78,1.27; 33 20.32,-1.27; 34 20.32,1.27
TO220BV = drill 1.016 long: G 2.54,-2.54; T1 -2.54,-2.54; T2 0,-2.54
SOT23-BEC = smd 1 x 1.4: B -0.95,-1.1; C 0,1.1; E 0.95,-1.1
DIL08 = drill 0.813 long: 1 -3.81,-3.81; 2 -1.27,-3.81; 3 1.27,-3.81; 4 3.81,-3.81; 5 3.81,3.81; 6 1.27,3.81; 7 -1.27,3.81; 8 -3.81,3.81
22-23-2021 = drill 1 long: 1 -1.27,0; 2 1.27,0
W237-102 = drill 1.194 long: 1 -2.54,-1.27; 2 2.54,-1.27

### Placement (x,y rotation side)
BAT1  101.92,31.43 90 top
C1  23.5,34.92 90 top
C2  23.5,48.58 90 top
C3  23.5,62.23 90 top
C4  18.73,5.71 90 top
C5  41.27,5.71 90 top
FM1  26.99,122.87 0 top
FM2  42.23,122.87 0 top
IC1  31.11,21.59 90 top
IC2  53.34,21.59 90 top
IC3  86.68,19.68 90 top
J2  70.8,92.71 90 top
J3  129.22,92.71 90 top
JP1  99.06,125.41 0 top
JP2  57.15,35.88 90 top
LED1  20.64,80.96 90 top
LED2  20.64,88.58 90 top
LED3  20.64,93.66 90 top
LED4  20.64,101.28 90 top
OK1  42.55,41.27 90 top
OK2  42.55,54.93 90 top
OK3  42.55,68.58 90 top
Q1  113.03,61.59 180 top
R1  123.51,24.45 0 bottom
R2  123.51,27.62 180 bottom
R3  123.51,16.51 0 bottom
R4  123.51,19.68 180 bottom
R5  123.51,48.26 0 bottom
R6  123.51,51.44 180 bottom
R7  123.19,40.32 0 bottom
R8  123.19,43.5 180 bottom
R9  123.51,32.38 0 bottom
R10  123.51,35.56 180 bottom
R11  123.19,56.2 0 bottom
R12  123.19,59.37 180 bottom
R13  123.51,8.57 0 bottom
R14  123.51,11.75 180 bottom
R15  119.38,70.8 180 top
R16  50.8,38.73 0 bottom
R17  26.99,37.47 90 top
R18  34.92,42.55 90 top
R19  19.37,36.2 270 top
R20  50.8,52.39 0 bottom
R21  26.99,51.12 90 top
R22  34.61,56.2 90 top
R23  19.37,49.85 270 top
R24  50.8,66.04 0 bottom
R25  26.99,64.77 90 top
R26  34.61,69.85 90 top
R27  19.37,63.5 270 top
R28  74.3,60.96 270 bottom
R29  25.08,80.96 0 top
R30  7.94,83.5 180 bottom
R31  25.08,88.58 0 top
R32  7.94,88.58 180 bottom
R33  40.64,80.96 0 bottom
R34  40.64,88.58 0 bottom
R35  25.4,93.66 0 top
R36  7.94,93.66 180 bottom
R37  25.08,101.28 0 top
R38  7.94,98.74 180 bottom
R39  40.64,93.66 0 bottom
R40  40.32,101.28 0 bottom
R41  18.73,12.7 90 top
R42  40.01,22.23 270 top
R43  33.66,15.24 90 top
R44  30.8,15.24 90 top
R45  37.47,22.23 270 top
R46  37.47,17.78 270 top
R47  23.18,12.06 180 top
R48  40.01,17.78 270 top
R49  41.27,12.7 90 top
R50  62.55,22.23 270 top
R51  55.88,15.24 90 top
R52  53.02,15.24 90 top
R53  60.01,22.23 270 top
R54  60.01,17.78 270 top
R55  45.4,12.06 180 top
R56  62.55,17.78 270 top
R57  93.98,20.32 180 top
R58  93.98,22.54 180 top
R59  79.38,21.59 0 top
R60  79.38,19.37 0 top
R61  119.38,68.58 180 top
R62  119.38,66.36 180 top
SG1  71.44,51.44 180 top
SV1  92.71,92.71 90 top
T1  28.57,41.27 90 top
T2  28.57,54.93 90 top
T3  28.57,68.58 90 top
T4  75.25,55.56 180 bottom
U4  33.02,84.77 90 top
U5  33.02,97.47 90 top
U6  106.05,64.77 90 top
X1  129.22,26.04 90 top
X2  129.22,18.1 90 top
X3  129.22,49.85 90 top
X4  129.22,41.91 90 top
X5  129.22,33.97 90 top
X6  129.22,57.78 90 top
X7  129.22,10.16 90 top
X8  13.34,38.73 270 top
X9  13.34,52.39 270 top
X10  13.34,66.04 270 top
X11  13.65,80.96 270 top
X12  13.65,91.12 270 top
X13  13.65,101.28 270 top
X14  10.79,8.89 0 top
X15  31.11,8.89 0 top
X16  53.34,8.89 0 top
X17  75.56,8.89 0 top
X18  97.79,8.89 0 top
X19  78.11,36.2 0 top
X20  67.31,36.2 0 top

### Tracks (layer width: path | path; a pad name or v marks a point on that pad's centre or on a via)
+3V3  (via drill 0.61 pad 1.14)
  Top 0.406: FM2.2 39.05,121.92 39.37,122.24 49.21,122.24 49.85,122.87 49.85,129.86 48.9,130.81 23.18,130.81 21.27,128.91 21.27,123.19 21.91,122.56 23.5,122.56 23.81,122.24 FM1.2 23.81,115.57 27.62,111.76 50.48,111.76 52.7,109.54 v52.7,104.78 | v83.19,114.62 v83.19,95.25
  Top 0.61: R62.1 121.6,66.36 121.92,66.67 121.92,68.58 | 121.92,68.58 121.92,70.48 | 121.92,70.48 121.6,70.8 R15.1 | R61.1 121.92,68.58 | U6.8 98.74,62.87 | 98.74,62.87 90.17,62.87 88.58,64.45 88.58,89.85 v83.19,95.25 | 121.92,70.48 121.92,72.07 121.28,72.71 106.36,72.71 104.14,70.48 100.33,70.48 98.74,68.9 98.74,62.87
  Bottom 0.406: v83.19,114.62 83.19,114.94 88.9,120.97 JP1.1 | v83.19,95.25 83.19,96.2 75.25,104.14 J2.29 70.8,105.41 53.34,105.41 v52.7,104.78
+5V  (via drill 0.61 pad 1.14)
  Top 0.406: IC3.8 86.04,17.78 86.68,17.14 v86.68,4.13
  Top 0.61: IC1.8 28.52,13.39 | 28.52,13.39 31.11,10.79 31.11,4.76 31.75,4.13 v38.1,4.13 | IC2.8 50.74,13.39 | 50.74,13.39 53.34,10.79 53.34,4.76 53.98,4.13 v60.33,4.13 | 27.62,13.34 20.95,13.34 20.17,14.12 R41.2 | 27.62,13.34 28.45,13.34 28.52,13.39 | 50.74,13.39 50.68,13.34 43.18,13.34 42.41,14.1 R49.2 | 27.62,13.34 28.42,14.13
  Top 0.813: v69.22,62.23 70.8,60.64 76.83,60.64 | 76.83,60.64 v102.55,60.64 | v76.83,81.28 76.83,60.64
  Bottom 0.813: SG1.+ 67.63,60.64 v69.22,62.23 | J2.11 v76.83,81.28
  Bottom 1.016: 133.99,59.05 134.62,58.42 | 134.62,58.42 134.62,51.75 | 134.62,51.75 134.62,51.12 | 134.62,51.12 134.62,50.48 | 134.62,50.48 134.62,43.81 | 134.62,43.81 134.62,42.86 | 134.62,42.86 134.62,42.55 | 134.62,42.55 134.62,35.88 | 134.62,35.88 134.62,34.92 | 134.62,34.92 134.62,34.61 | 134.62,34.61 134.62,27.94 | 134.62,27.94 134.62,27.3 | 134.62,27.3 134.62,26.67 | 134.62,26.67 134.62,20 | 134.62,20 134.62,19.37 | 134.62,19.37 134.62,18.73 | 134.62,18.73 134.62,12.06 | 134.62,12.06 134.62,11.43 | 134.62,11.43 134.62,10.79 | 134.62,10.79 134.62,7.62 131.13,4.13 v86.68,4.13 v60.33,4.13 v38.1,4.13 9.21,4.13 8.26,5.08 X14.1 | X7.2 133.99,11.43 | 133.99,11.43 134.62,11.43 | X2.2 133.99,19.37 | 133.99,19.37 134.62,19.37 | X1.2 133.99,27.3 | 133.99,27.3 134.62,27.3 | X5.2 133.99,35.24 | 133.99,35.24 134.3,35.24 134.62,34.92 | X4.2 133.99,43.18 | 133.99,43.18 134.3,43.18 134.62,42.86 | X3.2 133.99,51.12 | 133.99,51.12 134.62,51.12 | SV1.1 93.98,69.22 v102.55,60.64 99.38,63.82 133.67,63.82 134.62,62.87 134.62,59.69 | 134.62,59.69 133.99,59.05 | 133.99,59.05 X6.2 | 134.62,58.42 134.62,59.69 | 134.62,50.48 133.99,51.12 | 133.99,51.12 134.62,51.75 | 134.62,42.55 133.99,43.18 | 133.99,43.18 134.62,43.81 | 134.62,34.61 133.99,35.24 | 133.99,35.24 134.62,35.88 | 134.62,26.67 133.99,27.3 | 133.99,27.3 134.62,27.94 | 134.62,18.73 133.99,19.37 | 133.99,19.37 134.62,20 | 134.62,10.79 133.99,11.43 | 133.99,11.43 134.62,12.06
+16VDC
  Bottom 1.016: X11.2 31.43,78.42 32.07,79.06 32.07,83.5 | 32.07,83.5 32.07,86.04 | 32.07,86.04 32.07,96.2 | 32.07,96.2 32.07,98.11 31.43,98.74 U5.6 | U5.7 32.07,96.2 | U4.6 32.07,86.04 | U4.7 32.07,83.5
ADC1  (via drill 0.61 pad 1.14)
  Top 0.406: IC1.1 34.92,19.68 35.56,19.05 35.56,17.46 36.09,16.93 R46.2 R48.2 41.7,16.93 v42.86,18.1
  Bottom 0.813: v42.86,18.1 42.86,20 43.5,20.64 55.56,20.64 56.2,21.27 56.2,31.11 58.42,33.34 JP2.1
ADC2  (via drill 0.61 pad 1.14)
  Top 0.406: IC2.1 57.78,19.68 58.1,19.37 58.1,17.46 58.63,16.93 R54.2 R56.2 66.46,16.93 v66.67,17.14
  Bottom 0.813: X19.1 76.83,27.3 v66.67,17.14
ADC3  (via drill 0.61 pad 1.14)
  Top 0.406: IC3.6 86.04,20.32 86.36,20.64
  Top 0.61: IC3.7 85.72,19.05 86.36,19.68 86.36,20.64 86.36,22.54 85.72,23.18 85.72,33.02 85.09,33.66 v73.34,33.66
  Bottom 0.406: JP2.2 57.15,35.88 61.28,35.88 63.5,33.66 v73.34,33.66
DIFF_RX_0+
  Bottom 0.406: JP1.5 99.06,128.27 97.79,129.54 86.36,129.54 84.45,127.64 84.45,121.28 80.01,116.84 J2.39
DIFF_RX_0-
  Bottom 0.406: JP1.6 101.6,128.91 100.01,130.49 85.72,130.49 83.19,127.95 83.19,121.6 80.01,118.43 71.12,118.43 J2.40
DIFF_RX_1+
  Bottom 0.406: JP1.3 93.98,127 93.34,127.64 87.63,127.64 86.68,126.68 86.68,120.33 80.64,114.3 J2.37
DIFF_RX_1-
  Bottom 0.406: JP1.4 96.52,127.64 95.57,128.59 87,128.59 85.72,127.32 85.72,120.97 80.33,115.57 70.8,115.57 J2.38
DIFF_RX_4+  (via drill 0.61 pad 1.14)
  Top 0.406: FM2.1 37.78,117.16 38.42,116.52 53.66,116.52 59.69,110.49 v59.69,107.95
  Bottom 0.406: J2.31 70.8,107.95 v59.69,107.95
DIFF_RX_4-  (via drill 0.61 pad 1.14)
  Top 0.406: FM2.8 46.67,118.75 46.99,118.43 54.93,118.43 63.5,109.86 v63.5,106.68
  Bottom 0.406: J2.32 v63.5,106.68
DIFF_RX_5+  (via drill 0.61 pad 1.14)
  Top 0.406: FM2.7 45.4,117.79 45.72,117.47 54.29,117.47 62.23,109.54 v62.23,102.87
  Bottom 0.406: J2.27 70.8,102.87 v62.23,102.87
DIFF_RX_5-  (via drill 0.61 pad 1.14)
  Top 0.406: FM2.9 48.32,125.47 v48.58,125.73 | v48.58,120.33 54.61,120.33 65.09,109.86 v65.09,101.6
  Bottom 0.406: J2.28 v65.09,101.6
  Bottom 0.813: v48.58,125.73 v48.58,120.33
DIFF_RX_6+  (via drill 0.61 pad 1.14)
  Top 0.406: FM1.1 22.54,114.94 26.67,110.81 49.85,110.81 51.44,109.22 v51.44,100.33
  Bottom 0.406: J2.25 70.8,100.33 v51.44,100.33
DIFF_RX_6-  (via drill 0.61 pad 1.14)
  Top 0.406: FM1.8 31.43,114.62 32.38,113.67 51.75,113.67 55.56,109.86 v55.56,99.06
  Bottom 0.406: J2.26 v55.56,99.06
DIFF_RX_7+  (via drill 0.61 pad 1.14)
  Top 0.406: FM1.7 30.16,113.67 31.11,112.71 51.12,112.71 53.98,109.86 v53.98,97.79
  Bottom 0.406: J2.23 70.8,97.79 v53.98,97.79
DIFF_RX_7-  (via drill 0.61 pad 1.14)
  Top 0.406: FM1.9 31.43,123.51 32.7,122.24 32.7,115.57 33.66,114.62 52.39,114.62 56.83,110.17 v56.83,96.52
  Bottom 0.406: J2.24 v56.83,96.52
DIFF_RX_8+  (via drill 0.61 pad 1.14)
  Top 0.406: FM1.15 23.81,127.95 24.45,128.59 35.56,128.59 36.2,127.95 36.2,123.83 36.51,123.51 38.73,123.51 39.05,123.83 FM2.15 39.05,129.22 39.37,129.54 v41.91,129.54
  Bottom 0.406: J2.21 70.8,95.25 53.34,95.25 46.35,102.23 46.35,127.95 44.77,129.54 v41.91,129.54
DIFF_RX_8-  (via drill 0.61 pad 1.14)
  Top 0.406: FM1.16 22.54,128.27 23.81,129.54 36.83,129.54 37.78,128.59 v37.78,128.27 FM2.16
  Bottom 0.406: J2.22 53.02,93.98 44.77,102.23 44.77,127.32 43.81,128.27 v37.78,128.27
DIFF_RX_9+
  Bottom 0.406: J2.19 87,91.44 88.9,89.53 88.9,70.8 100.33,59.37 R12.1
  Bottom 0.61: R11.2 R12.1
DIFF_RX_9-  (via drill 0.61 pad 1.14)
  Top 0.406: v80.64,76.83 v80.64,92.71
  Bottom 0.406: R14.1 117.16,11.75 115.25,13.65 115.25,52.07 113.67,53.66 96.52,53.66 80.64,69.53 v80.64,76.83 | v80.64,92.71 70.8,92.71 J2.20
  Bottom 0.61: R13.2 R14.1
DIFF_RX_A+
  Bottom 0.406: J2.17 87,88.9 87.95,87.95 87.95,70.17 99.69,58.42 116.84,58.42 120.02,55.24 120.02,52.07 120.65,51.44 R6.1
  Bottom 0.61: R5.2 R6.1
DIFF_RX_A-  (via drill 0.61 pad 1.14)
  Top 0.406: v85.41,74.3 v85.41,90.17
  Bottom 0.406: R10.1 120.02,35.56 118.11,37.47 118.11,53.98 115.57,56.52 98.42,56.52 85.41,69.53 v85.41,74.3 | v85.41,90.17 70.8,90.17 J2.18
  Bottom 0.61: R9.2 R10.1
DIFF_RX_B+  (via drill 0.61 pad 1.14)
  Top 0.406: v83.82,76.83 v83.82,86.04
  Bottom 0.406: R2.1 122.34,27.52 117.89,27.52 117.16,28.26 117.16,53.34 114.94,55.56 97.79,55.56 83.82,69.53 v83.82,76.83 | v83.82,86.04 81.28,86.04 80.96,86.36 J2.15
  Bottom 0.61: R1.2 R2.1
DIFF_RX_B-  (via drill 0.61 pad 1.14)
  Top 0.406: v82.23,74.3 v82.23,87.63
  Bottom 0.406: R4.1 117.47,19.68 116.2,20.95 116.2,52.7 114.3,54.61 97.16,54.61 82.23,69.53 v82.23,74.3 | v82.23,87.63 70.8,87.63 J2.16
  Bottom 0.61: R3.2 R4.1
GND  (via drill 0.61 pad 1.14)
  Top 0.406: FM1.10 30.16,127.32 30.48,127.64 34.61,127.64 35.24,127 35.24,123.19 35.56,122.87 | 35.56,122.87 45.09,122.87 45.4,123.19 FM2.10 | 35.56,122.87 35.24,122.56 35.24,116.2 35.88,115.57 53.02,115.57 58.1,110.49 58.1,104.46 58.74,103.82 v58.74,102.87 | U6.4 110.81,66.67 111.12,66.36
  Top 0.61: U6.4 111.12,66.67 | IC2.4 57.47,23.5 v58.42,24.45 | IC1.4 34.92,23.5 v35.88,24.45
  Bottom 0.406: J2.30 58.42,104.14 58.74,103.5 v58.74,102.87
  Bottom 0.61: J3.8 129.22,77.47 134.3,77.47 | SV1.2 92.71,73.66 97.16,73.66
  other vias: 129.22,13.97 129.54,21.91 129.54,29.84 129.54,37.78 129.54,45.72 129.22,53.66 129.22,61.59 102.87,118.75 99.06,72.39
  pour Bottom (isolate 0.813): -0.95,135.89 140.97,135.89 140.97,-0.64 -0.64,-0.64 -0.64,27.3 44.45,27.3 44.45,77.15 34.29,77.15 34.29,107.31 -0.95,107.31
  pour Top (isolate 0.813): -0.95,135.89 140.97,135.89 140.97,-0.64 -0.64,-0.64 -0.64,27.3 44.45,27.3 44.45,77.15 34.29,77.15 34.29,107.31 -0.95,107.31
GPIO01  (via drill 0.61 pad 1.14)
  Top 0.406: v43.81,79.38 v43.81,93.66
  Bottom 0.406: J2.1 70.8,67.31 56.2,67.31 53.02,70.48 53.02,78.42 52.07,79.38 v43.81,79.38 | R39.1 v43.81,93.66
GPIO02
  Bottom 0.406: J2.2 56.83,68.58 54.29,71.12 54.29,80.33 53.66,80.96 R33.1
GPIO03
  Bottom 0.406: J2.3 70.8,69.85 57.15,69.85 55.56,71.44 55.56,84.45 51.44,88.58 R34.1
GPIO04
  Bottom 0.406: J2.4 57.47,71.12 56.83,71.75 56.83,84.77 46.35,95.25 41.91,95.25 41.27,95.89 41.27,101.28 R40.1
GPIO05  (via drill 0.61 pad 1.14)
  Top 0.406: v63.5,65.72 v63.5,72.39
  Bottom 0.406: J2.5 70.8,72.39 v63.5,72.39
  Bottom 0.813: R16.1 51.65,49.74 53.02,51.12 53.02,61.28 54.29,62.55 62.55,62.55 63.5,63.5 v63.5,65.72
GPIO06  (via drill 0.61 pad 1.14)
  Top 0.406: v61.28,65.72 v61.28,73.66
  Bottom 0.406: J2.6 v61.28,73.66
  Bottom 0.813: R20.1 51.65,62.13 53.34,63.82 60.64,63.82 61.28,64.45 v61.28,65.72
GPIO07  (via drill 0.61 pad 1.14)
  Top 0.406: v59.05,65.72 v59.05,74.93
  Bottom 0.406: J2.7 70.8,74.93 v59.05,74.93
  Bottom 0.813: R24.1 52.39,66.04 52.7,65.72 v59.05,65.72
GPIO08
  Bottom 0.406: J2.8 70.8,77.47 73.34,77.47 74.3,76.52 R28.1
GPIO09
  Bottom 0.406: R8.1 119.7,43.5 119.06,44.13 119.06,54.61 116.2,57.47 99.06,57.47 87,69.53 87,77.79 86.04,78.74 J2.9
  Bottom 0.61: R7.2 R8.1
GPIOA  (via drill 0.61 pad 1.14)
  Top 0.406: U6.7 100.65,64.14 100.01,64.77 100.01,67.94 101.28,69.22 104.78,69.22 106.36,70.8 v116.84,70.8
  Top 0.813: R15.2 v116.84,70.8
  Bottom 0.406: J3.5 129.22,72.39 126.36,72.39 124.78,70.8
  Bottom 0.61: 124.78,70.8 v116.84,70.8
GPIOB  (via drill 0.61 pad 1.14)
  Top 0.406: v107,118.43 107,116.84 107.95,115.89 107.95,81.28 101.6,74.93 v101.6,72.39
  Bottom 0.406: v101.6,72.39 124.78,72.39 126.05,73.66 J3.6
  Bottom 0.813: JP1.7 104.14,121.28 v107,118.43
I2C_SCL  (via drill 0.61 pad 1.14)
  Top 0.406: U6.6 101.6,65.41 101.28,65.72 101.28,67.63 101.6,67.94 105.09,67.94 107,69.85 114.94,69.85 116.2,68.58 v116.84,68.58
  Top 0.813: R61.2 v116.84,68.58
  Bottom 0.406: J3.4 126.68,71.12 123.83,68.58 v116.84,68.58
I2C_SDA  (via drill 0.61 pad 1.14)
  Top 0.406: U6.5 105.73,66.67 107.95,68.9 113.67,68.9 116.2,66.36 v116.84,66.36
  Top 0.813: R62.2 v116.84,66.36
  Bottom 0.406: J3.3 129.22,69.85 127,69.85 123.51,66.36 v116.84,66.36
LCD_BLCNT
  Bottom 0.406: J2.34 70.8,110.49 73.03,110.49 79.38,104.14 92.71,104.14 SV1.27
LCD_CS  (via drill 0.61 pad 1.14)
  Top 0.406: v110.17,105.41 v110.17,95.25
  Bottom 0.406: J3.31 129.22,105.41 v110.17,105.41 | SV1.19 v110.17,95.25
LCD_DB0  (via drill 0.61 pad 1.14)
  Top 0.406: v123.83,82.55 v123.83,73.66
  Bottom 0.406: SV1.3 104.78,74.93 106.05,73.66 v123.83,73.66 | J3.13 129.22,82.55 v123.83,82.55
LCD_DB1  (via drill 0.61 pad 1.14)
  Top 0.406: v122.56,91.44 122.56,76.2 121.92,75.56 v121.92,74.93
  Bottom 0.406: SV1.4 92.71,76.2 105.41,76.2 106.68,74.93 v121.92,74.93 | J3.20 v122.56,91.44
LCD_DB2  (via drill 0.61 pad 1.14)
  Top 0.406: v121.28,85.09 121.28,78.42 120.02,77.15 v120.02,76.2
  Bottom 0.406: SV1.5 106.05,77.47 107.31,76.2 v120.02,76.2 | J3.15 129.22,85.09 v121.28,85.09
LCD_DB3  (via drill 0.61 pad 1.14)
  Top 0.406: v115.25,94.61 v115.25,78.74
  Bottom 0.406: SV1.6 92.71,78.74 v115.25,78.74 | J3.22 115.89,93.98 v115.25,94.61
LCD_DB4  (via drill 0.61 pad 1.14)
  Top 0.406: v110.17,80.01 v110.17,91.76
  Bottom 0.406: SV1.7 v110.17,80.01 | v110.17,91.76 114.3,91.76 115.89,90.17 129.22,90.17 J3.19
LCD_DB5  (via drill 0.61 pad 1.14)
  Top 0.406: v113.98,81.28 v113.98,96.52
  Bottom 0.406: SV1.8 92.71,81.28 v113.98,81.28 | J3.24 v113.98,96.52
LCD_DB6  (via drill 0.61 pad 1.14)
  Top 0.406: v117.79,101.6 v117.79,82.55
  Bottom 0.406: SV1.9 v117.79,82.55 | J3.28 v117.79,101.6
LCD_DB7  (via drill 0.61 pad 1.14)
  Top 0.406: v102.23,104.14 v102.23,83.82
  Bottom 0.406: SV1.10 92.71,83.82 v102.23,83.82 | J3.30 v102.23,104.14
LCD_DB8  (via drill 0.61 pad 1.14)
  Top 0.406: v116.52,92.71 v116.52,85.09
  Bottom 0.406: SV1.11 v116.52,85.09 | J3.21 129.22,92.71 v116.52,92.71
LCD_DB9  (via drill 0.61 pad 1.14)
  Top 0.406: v99.06,106.68 v99.06,86.36
  Bottom 0.406: SV1.12 92.71,86.36 v99.06,86.36 | J3.32 v99.06,106.68
LCD_DB10  (via drill 0.61 pad 1.14)
  Top 0.406: v121.28,95.25 v121.28,87.63
  Bottom 0.406: J3.23 129.22,95.25 v121.28,95.25 | SV1.13 v121.28,87.63
LCD_DB11  (via drill 0.61 pad 1.14)
  Top 0.406: v123.83,111.76 v123.83,88.9
  Bottom 0.406: J3.36 v123.83,111.76 | v123.83,88.9 92.71,88.9 SV1.14
LCD_DB12  (via drill 0.61 pad 1.14)
  Top 0.406: v112.71,100.33 v112.71,90.17
  Bottom 0.406: J3.27 129.22,100.33 v112.71,100.33 | v112.71,90.17 SV1.15
LCD_DB13  (via drill 0.61 pad 1.14)
  Top 0.406: v104.78,91.44 v104.78,114.3
  Bottom 0.406: J3.38 v104.78,114.3 | SV1.16 92.71,91.44 v104.78,91.44
LCD_DB14  (via drill 0.61 pad 1.14)
  Top 0.406: v106.36,92.71 v106.36,102.87
  Bottom 0.406: J3.29 129.22,102.87 v106.36,102.87 | SV1.17 v106.36,92.71
LCD_DB15  (via drill 0.61 pad 1.14)
  Top 0.406: v97.79,93.98 v97.79,116.84
  Bottom 0.406: J3.40 v97.79,116.84 | SV1.18 92.71,93.98 v97.79,93.98
LCD_RD
  Bottom 0.406: J2.33 83.5,97.79 SV1.22
LCD_RESET  (via drill 0.61 pad 1.14)
  Top 0.406: v115.89,98.42 v115.89,113.03
  Bottom 0.406: J3.37 129.22,113.03 v115.89,113.03 | SV1.23 104.78,100.33 106.68,98.42 v115.89,98.42
LCD_RS  (via drill 0.61 pad 1.14)
  Top 0.406: v87,113.03 v87,95.25
  Bottom 0.406: J2.36 70.8,113.03 v87,113.03
  Bottom 0.813: SV1.20 v87,95.25
LCD_WR  (via drill 0.61 pad 1.14)
  Top 0.406: v103.5,97.47 v103.5,110.49
  Bottom 0.406: J3.35 130.18,111.76 128.91,110.49 v103.5,110.49 | v103.5,97.47 94.3,97.47 SV1.21
LVDS_TX_B+  (via drill 0.61 pad 1.14)
  Top 0.406: v111.44,118.75 v111.44,83.82
  Bottom 0.406: J3.12 121.28,81.28 118.75,83.82 v111.44,83.82
  Bottom 0.813: JP1.9 109.22,120.97 v111.44,118.75
LVDS_TX_B-  (via drill 0.61 pad 1.14)
  Top 0.406: v108.9,118.75 v108.9,77.47
  Bottom 0.406: v108.9,77.47 124.14,77.47 126.68,80.01 129.22,80.01 J3.11
  Bottom 0.813: JP1.8 106.68,120.97 v108.9,118.75
N$1
  Top 0.61: U6.1 111.44,62.87 111.76,62.55
  Top 1.016: 111.76,62.55 Q1.2
N$2
  Bottom 0.61: R1.1 126.68,24.45 127,24.77 X1.1
N$3
  Bottom 0.61: R3.1 126.68,16.51 127,16.83 X2.1
N$4
  Bottom 0.61: R5.1 126.68,48.26 127,48.58 X3.1
N$5
  Bottom 0.61: R7.1 126.68,40.32 127,40.64 X4.1
N$6
  Bottom 0.61: R9.1 126.68,32.38 127,32.7 X5.1
N$7
  Bottom 0.61: R11.1 127,56.2 127.32,56.52 X6.1
N$8
  Bottom 0.61: R13.1 126.68,8.57 127,8.89 X7.1
N$9
  Top 0.61: U6.2 113.35,64.14 114.3,63.18
  Top 1.016: 114.3,63.18 Q1.1
N$10
  Bottom 0.813: OK1.1 R16.2
N$11
  Bottom 0.61: T4.B 74.3,59.16 R28.2
N$12
  Bottom 0.813: OK2.1 R20.2
N$13
  Bottom 2: T1.G 34.92,43.81 | 34.92,43.81 OK1.4 | R18.2 34.92,43.81
N$14
  Bottom 2: R17.1 26.99,35.56 27.62,36.2 38.1,36.2 38.73,36.83 OK1.6
N$15
  Bottom 2: X8.1 R19.1 R17.2 T1.T2
N$16
  Bottom 2: X8.2 20.95,36.2 C1.2 T1.T1 R18.1
N$17
  Bottom 2: C1.1 R19.2
N$18
  Bottom 2: T2.G 34.61,57.47 | 34.61,57.47 OK2.4 | R22.2 34.61,57.47
N$19
  Bottom 2: R21.1 26.99,48.58 27.94,49.53 37.78,49.53 38.73,50.48 OK2.6
N$20
  Bottom 2: X9.1 R23.1 R21.2 T2.T2
N$21
  Bottom 2: R22.1 T2.T1 C2.2 20.95,49.85 X9.2
N$22
  Bottom 2: C2.1 R23.2
N$23
  Bottom 0.813: R24.2 OK3.1
N$24
  Bottom 2: T3.G 34.61,71.12 | 34.61,71.12 OK3.4 | R26.2 34.61,71.12
N$25
  Bottom 2: R25.1 26.99,62.23 27.94,63.18 38.1,63.18 38.73,63.82 OK3.6
N$26
  Bottom 2: X10.1 R27.1 R25.2 T3.T2
N$27
  Bottom 2: X10.2 20.95,63.5 C3.2 T3.T1 R26.1
N$28
  Bottom 2: C3.1 R27.2
N$29
  Bottom 0.61: SG1.- T4.C
N$30  (via drill 0.61 pad 1.14)
  Top 0.813: C4.+ v18.73,9.53 R41.1
  Bottom 0.813: R47.3 v18.73,9.53
N$31
  Bottom 0.406: U4.1 R33.2
N$32
  Top 0.813: R29.1 LED1.A
N$33
  Top 1.016: LED2.A R31.1
N$34
  Bottom 0.406: R34.2 U4.4
N$35  (via drill 0.61 pad 1.14)
  Top 0.61: U6.3 106.68,65.41 106.05,64.77 106.05,50.8 107.95,48.89 110.49,48.89 v112.39,48.9
  Bottom 1.27: BAT1.1 102.23,51.12 104.46,48.9 110.49,48.89 v112.39,48.9
N$36  (via drill 0.61 pad 1.14)
  Top 0.406: v23.81,17.78 23.81,23.18 24.13,23.5 IC1.5
  Bottom 0.813: R47.2 23.18,12.06 23.81,12.7 v23.81,17.78
N$37
  Top 1.016: LED3.A R35.1
N$39
  Top 1.016: LED4.A R37.1
N$40
  Bottom 0.406: R39.2 U5.1
N$41
  Bottom 0.406: R40.2 U5.4
N$42
  Top 0.406: IC1.6 30.16,22.23 30.48,21.91 | 30.48,21.91 30.48,21.27 30.16,20.95 IC1.7 | 30.48,21.91 30.48,25.4 30.9,25.82 39.59,25.82 40.01,25.4 R42.1
N$43
  Top 0.406: IC1.2 35.24,20.95 35.88,21.59 35.88,22.86 36.09,23.07 R45.1 38.52,23.07 38.73,22.86 38.73,21.59 38.95,21.38 R42.2
N$44
  Top 0.406: R46.1 R45.2
N$46  (via drill 0.61 pad 1.14)
  Top 0.406: R44.2 31.85,16.09 32.23,15.72 32.23,14.76 32.6,14.39 R43.1 36.41,14.39 v36.51,14.29
  Bottom 0.406: X15.2 33.66,11.43 v36.51,14.29
N$47
  Top 0.61: IC3.3 R57.2 R58.2
N$48
  Top 0.406: IC1.3 32.38,22.23 31.75,21.59 31.75,18.73 33.66,16.83 R43.2
N$49  (via drill 0.61 pad 1.14)
  Top 0.813: C5.+ v41.27,9.53 R49.1
  Bottom 0.813: R55.3 v41.27,9.53
N$50  (via drill 0.61 pad 1.14)
  Top 0.406: IC2.5 46.04,23.5 45.72,23.18 v45.72,17.78
  Bottom 0.813: R55.2 45.09,12.06 45.72,12.7 v45.72,17.78
N$51
  Top 0.406: IC2.7 52.39,20.95 52.7,21.27 52.7,21.91 | 52.7,21.91 52.39,22.23 IC2.6 | R50.1 62.55,25.4 61.91,26.04 53.02,26.04 52.7,25.72 52.7,21.91
N$52
  Top 0.406: IC2.2 57.78,20.95 58.42,21.59 58.42,22.86 58.74,23.18 59.91,23.18 R53.1 61.06,23.07 61.28,22.86 61.28,21.59 61.49,21.38 R50.2
N$53
  Top 0.406: R54.1 R53.2
N$54  (via drill 0.61 pad 1.14)
  Top 0.406: R52.2 54.24,16.09 54.45,15.88 54.45,14.61 54.67,14.39 R51.1 58.63,14.39 v58.74,14.29
  Bottom 0.813: X16.2 55.88,11.43 v58.74,14.29
N$55
  Top 0.406: IC2.3 54.29,22.23 53.98,21.91 53.98,18.73 55.88,16.83 R51.2
N$56  (via drill 0.61 pad 1.14)
  Top 0.61: IC3.2 87.63,19.05 87.31,19.37 | 87.31,19.37 v87.31,41.27 | IC3.1 87.63,17.78 87.31,18.1 87.31,19.37
  Bottom 0.61: v87.31,41.27 66.67,41.27 66.04,40.64 X20.1
N$57  (via drill 0.61 pad 1.14)
  Top 0.406: R57.1 94.83,16.73 91.76,13.65 v88.9,13.65
  Bottom 0.406: X17.2 78.11,13.02 78.74,13.65 v88.9,13.65
N$58
  Top 0.61: IC3.5 R59.2 R60.2
N$59  (via drill 0.61 pad 1.14)
  Top 0.406: R59.1 78.53,24.19 78.64,24.34 79.06,24.77 v80.01,24.77
  Bottom 0.813: X18.2 100.33,22.86 98.42,24.77 v80.01,24.77
PE  (via drill 0.61 pad 1.14)
  Top 1.016: v18.41,103.82 18.41,101.28 | 18.41,101.28 18.41,93.66 | 18.41,93.66 18.41,88.58 | 18.41,88.58 18.41,80.96 LED1.C | LED2.C 18.41,88.58 | LED3.C 18.41,93.66 | LED4.C 18.41,101.28
  Bottom 1.016: v18.41,103.82 X13.1 5.08,103.82 5.08,98.74 | R38.1 5.08,98.74 | 5.08,98.74 5.08,93.66 | 5.08,93.66 5.08,88.58 | 5.08,88.58 5.08,83.5 R30.1 | R32.1 5.08,88.58 | R36.1 5.08,93.66
R_CAMARA1
  Top 1.016: R35.2 U5.8
  Bottom 1.016: R36.2 X12.1
  Bottom 1.27: U5.8 X12.1
R_CAMARA2
  Top 1.016: R37.2 U5.5
  Bottom 1.016: R38.2 X13.2
  Bottom 1.27: U5.5 17.78,101.28 15.24,98.74 X13.2
R_SECADO1
  Top 0.813: U4.8 R29.2
  Bottom 1.016: R30.2 X11.1
  Bottom 1.27: U4.8 19.05,80.96 16.51,83.5 X11.1
R_SECADO2
  Top 1.016: R31.2 U4.5
  Bottom 1.016: R32.2 X12.2
  Bottom 1.27: U4.5 X12.2
TP_CS  (via drill 0.61 pad 1.14)
  Top 0.406: v119.06,85.09 119.06,98.74 119.38,99.06 v119.38,107.95
  Bottom 0.406: SV1.29 v119.38,107.95 | J3.14 122.87,83.82 122.56,83.5 120.65,83.5 v119.06,85.09
TP_IRQ
  Bottom 0.406: J2.35 73.34,111.76 79.69,105.41 SV1.28
TP_SCK  (via drill 0.61 pad 1.14)
  Top 0.406: v79.06,83.82 v79.06,107.95
  Bottom 0.406: J2.13 v79.06,83.82 | v79.06,107.95 SV1.30
TP_SI  (via drill 0.61 pad 1.14)
  Top 0.406: v100.97,110.49 v100.97,86.36
  Bottom 0.406: SV1.31 v100.97,110.49 | J3.16 v100.97,86.36
TP_SO  (via drill 0.61 pad 1.14)
  Top 0.406: v76.83,85.09 v76.83,110.49
  Bottom 0.406: J2.14 70.8,85.09 v76.83,85.09 | v76.83,110.49 SV1.32
(copper drawn outside any net)
  shapes: Top area x1

### Text on the board
tPlace: SD_CARD_MODULE | PE R.CAM2 R.CAM1 R.SEC2 R.SEC1 +16VDC | LCD_HEADER | AUXILIAR1 | E. LLENADO1 | FC_PUER1 | MULETI | E. DESCARGUE1 | MAX_CAM1 | EMERG1 | ADC1 GND | ADC2 GND | ADC3 | ADC1 | MIN_DEP1 | MAX_DEP1 | INICIO | +5VDC GND | GND TMC1 | GND TMC2 | GND TPRE1 | GND TPRE2